# EAGLE schematic MOTOR_DRIVER_dupl_everything_mount_holes (EAGLE 8.0.1)

## Sheet 1 of 8: Motor Driver Schematic
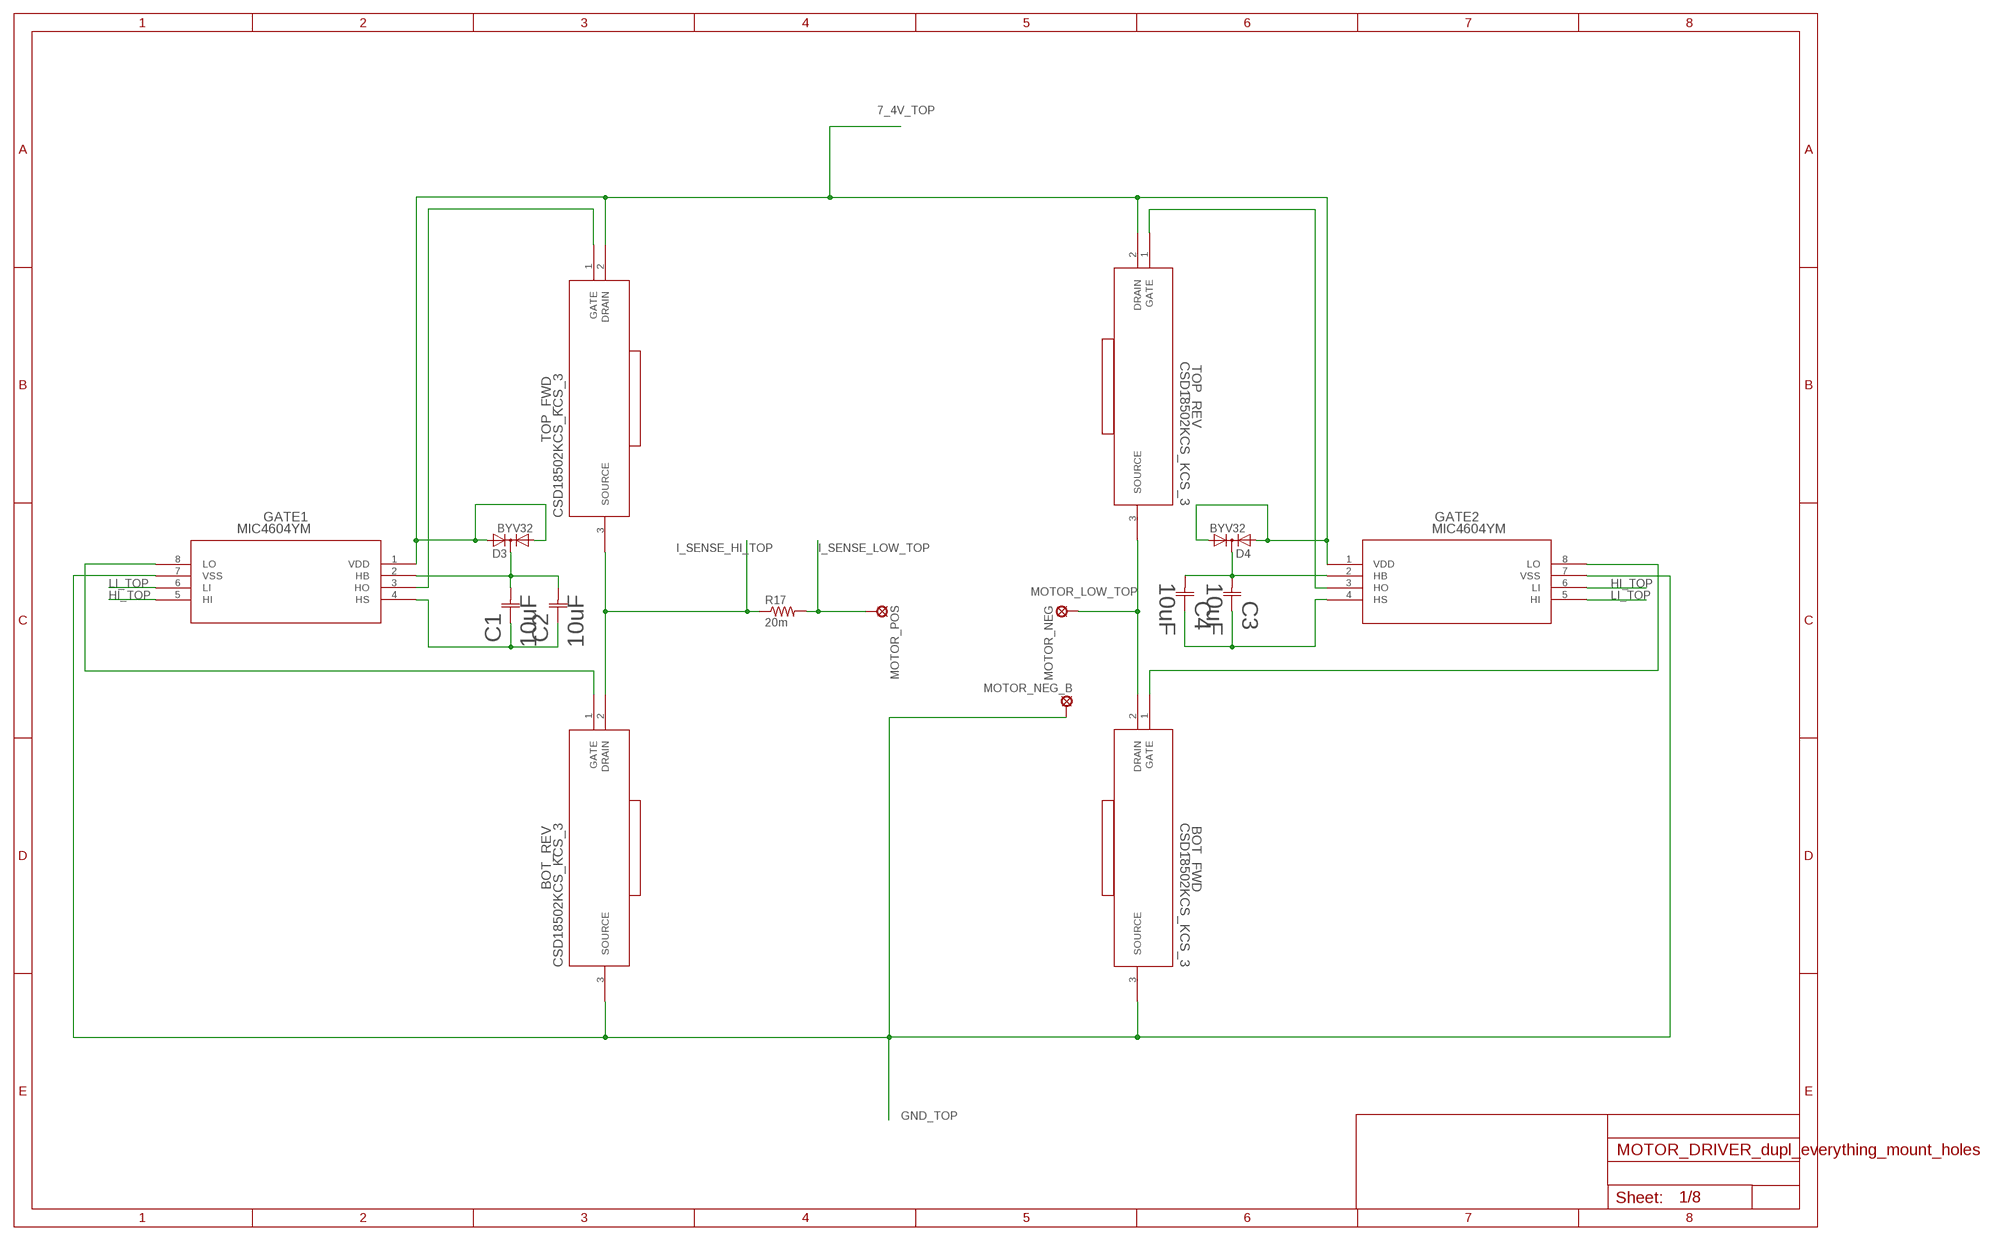
[diagram p0: schematic, sheet 1]

### Parts
BOT_FWD  CSD18502KCS_KCS_3  [KCS3]
BOT_REV  CSD18502KCS_KCS_3  [KCS3]
C1  10uF  EEE1VA100WR  [CAP_EEE_B]
C2  10uF  EEE1VA100WR  [CAP_EEE_B]
C3  10uF  EEE1VA100WR  [CAP_EEE_B]
C4  10uF  EEE1VA100WR  [CAP_EEE_B]
D3  BYV32  [TO220ABS]
D4  BYV32  [TO220ABS]
GATE1  MIC4604YM  [SOIC-8_M]
GATE2  MIC4604YM  [SOIC-8_M]
MOTOR_NEG  SE14  [SE14]
MOTOR_NEG_B  SE14  [SE14]
MOTOR_POS  SE14  [SE14]
R17  20m  R-US_R2512  [R2512]
TOP_FWD  CSD18502KCS_KCS_3  [KCS3]
TOP_REV  CSD18502KCS_KCS_3  [KCS3]
U$2  HEATSINK  [HEATSINK]
U$4  HEATSINK  [HEATSINK]
U$5  HEATSINK  [HEATSINK]
U$6  HEATSINK  [HEATSINK]

### Nets
7_4V_TOP: D3.A1 D3.A2 D4.A1 D4.A2 GATE1.1(VDD) GATE2.1(VDD) TOP_FWD.2(DRAIN) TOP_REV.2(DRAIN) ; also sheet 2,3,4
GND_TOP: BOT_FWD.3(SOURCE) BOT_REV.3(SOURCE) GATE1.7(VSS) GATE2.7(VSS) MOTOR_NEG_B.MP ; also sheet 2,3,4
HI_TOP: GATE1.5(HI) GATE2.6(LI) ; also sheet 3
I_SENSE_HI_TOP: BOT_REV.2(DRAIN) R17.1 TOP_FWD.3(SOURCE) ; also sheet 2
I_SENSE_LOW_TOP: MOTOR_POS.MP R17.2 ; also sheet 2,3
LI_TOP: GATE1.6(LI) GATE2.5(HI) ; also sheet 3
MOTOR_LOW_TOP: BOT_FWD.2(DRAIN) MOTOR_NEG.MP TOP_REV.3(SOURCE) ; also sheet 3
N$2: BOT_REV.1(GATE) GATE1.8(LO)
N$3: GATE1.3(HO) TOP_FWD.1(GATE)
N$4: C1.1 C2.1 GATE1.4(HS)
N$5: C1.2 C2.2 D3.C GATE1.2(HB)
N$9: BOT_FWD.1(GATE) GATE2.8(LO)
N$10: GATE2.3(HO) TOP_REV.1(GATE)
N$11: C3.1 C4.1 GATE2.4(HS)
N$12: C3.2 C4.2 D4.C GATE2.2(HB)

## Sheet 2 of 8: Microcontroller schematic
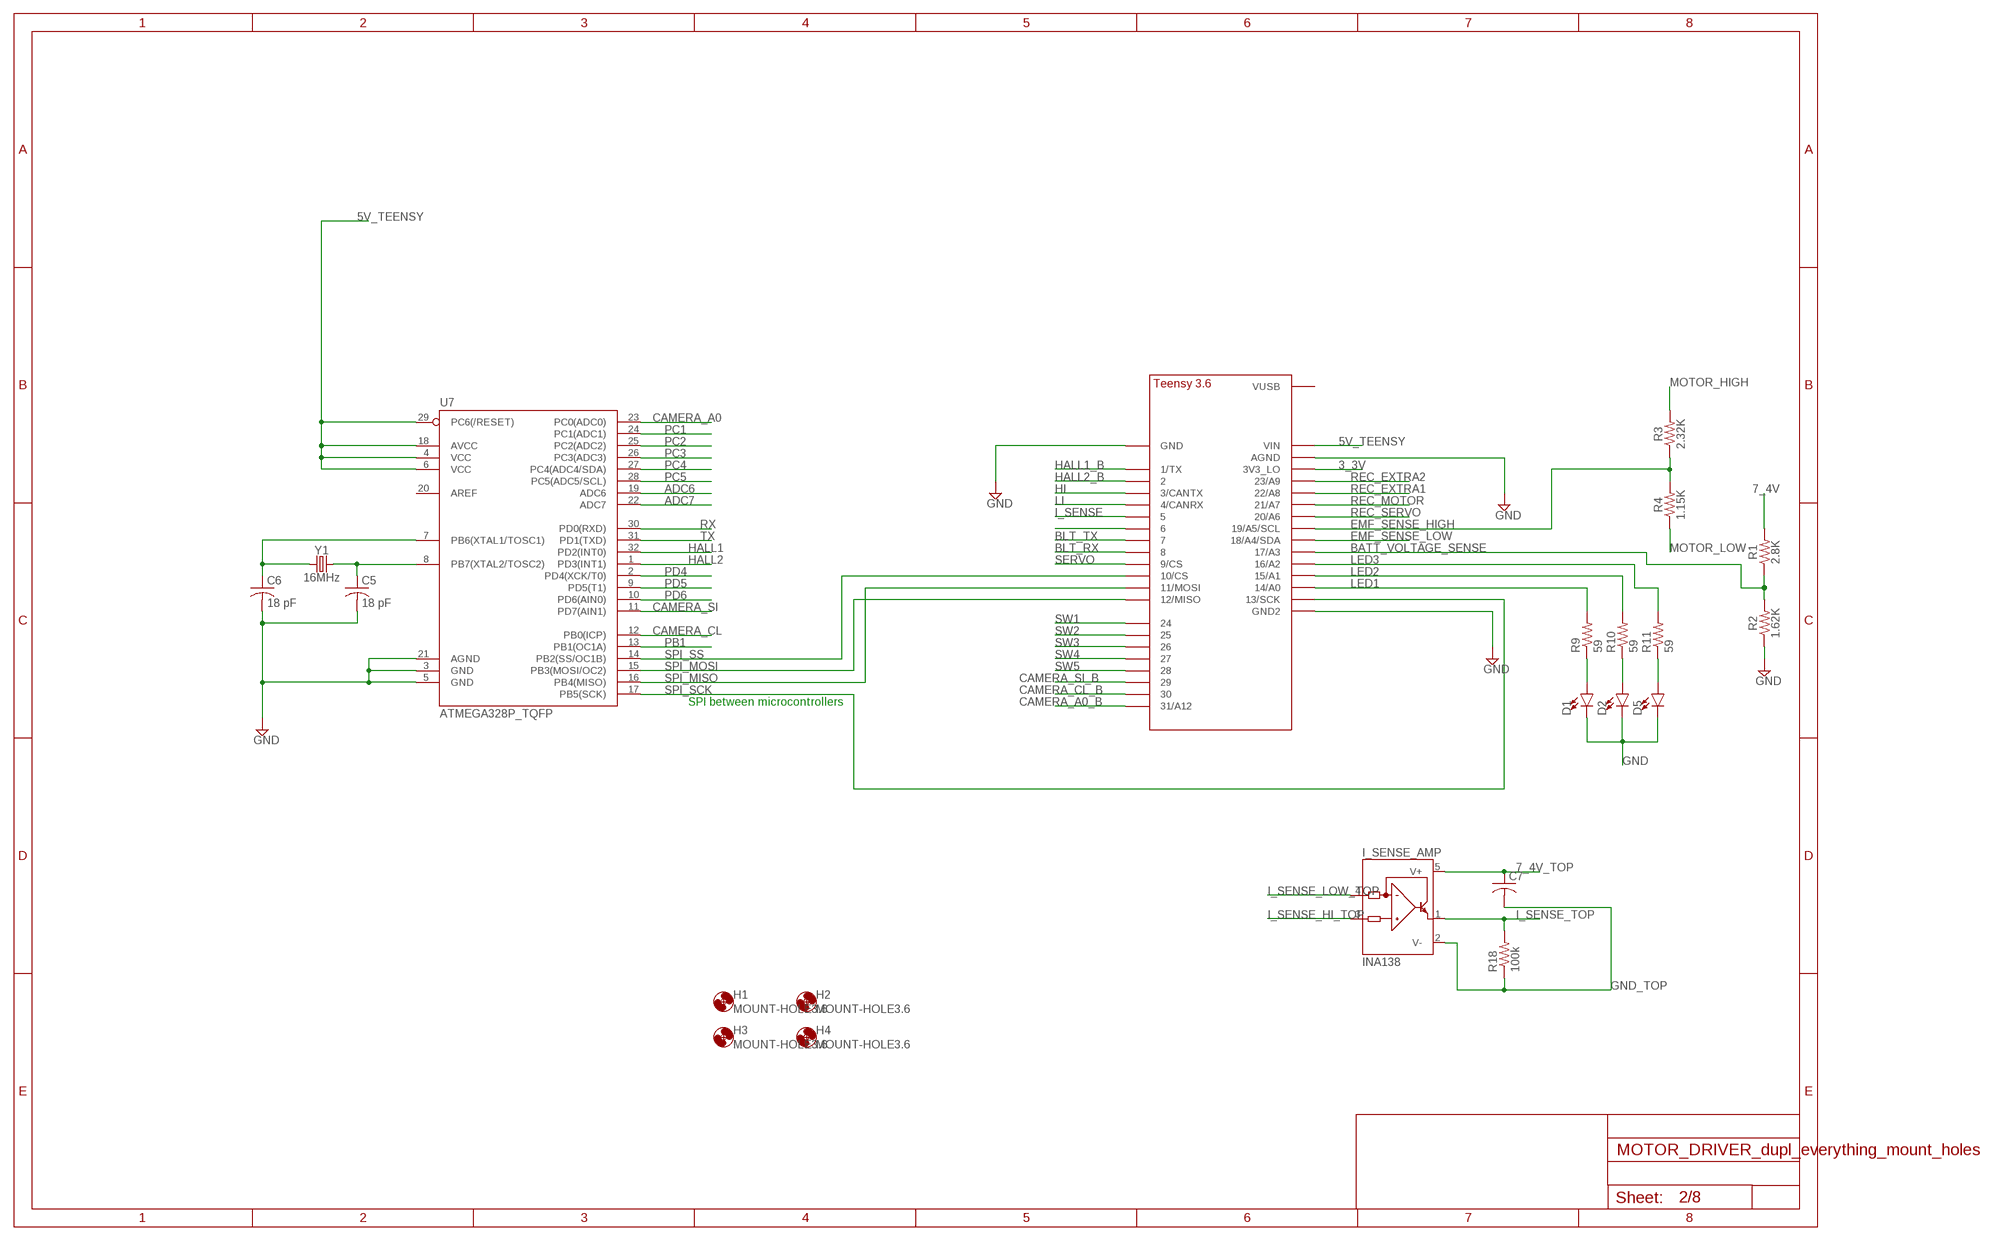
[diagram p1: schematic, sheet 2]

### Parts
C5  18 pF  C-USC0603  [C0603]
C6  18 pF  C-USC0603  [C0603]
C7  C-USC0603  [C0603]
D1  LED0603  [LED-0603]
D2  LED0603  [LED-0603]
D5  LED0603  [LED-0603]
H1  MOUNT-HOLE3.6  [3,6]
H2  MOUNT-HOLE3.6  [3,6]
H3  MOUNT-HOLE3.6  [3,6]
H4  MOUNT-HOLE3.6  [3,6]
I_SENSE_AMP  INA138  [SOT23-5]
R1  2.8K  0.3OHM-0805-1/8W-1%  [0805]
R2  1.62K  0.3OHM-0805-1/8W-1%  [0805]
R3  2.32K  0.3OHM-0805-1/8W-1%  [0805]
R4  1.15K  0.3OHM-0805-1/8W-1%  [0805]
R9  59  R-US_R0805  [R0805]
R10  59  R-US_R0805  [R0805]
R11  59  R-US_R0805  [R0805]
R18  100k  R-US_R0603  [R0603]
U7  ATMEGA328P_TQFP  [TQFP32-08]
U$1  TEENSY_3.5/3.6_FEWER  [TEENSY_3.5/3.6_BASIC_FEWER_PIN]
Y1  16MHz  CRYSTAL-16MHZPTH-HC49US  [HC49US]

### Nets
3_3V: U$1.3V3_LO ; also sheet 3
5V_TEENSY: U7.4(VCC) U7.6(VCC) U7.18(AVCC) U7.29(PC6(/RESET)) U$1.VIN ; also sheet 3
7_4V: R1.2 ; also sheet 3,4
7_4V_TOP: C7.1 I_SENSE_AMP.5(V+) ; also sheet 1,3,4
ADC6: U7.19(ADC6) ; also sheet 3
ADC7: U7.22(ADC7) ; also sheet 3
BATT_VOLTAGE_SENSE: R1.1 R2.2 U$1.17/A3
BLT_RX: U$1.8 ; also sheet 3
BLT_TX: U$1.7 ; also sheet 3
CAMERA_A0: U7.23(PC0(ADC0)) ; also sheet 3
CAMERA_A0_B: U$1.31/A12 ; also sheet 3
CAMERA_CL: U7.12(PB0(ICP)) ; also sheet 3
CAMERA_CL_B: U$1.30 ; also sheet 3
CAMERA_SI: U7.11(PD7(AIN1)) ; also sheet 3
CAMERA_SI_B: U$1.29 ; also sheet 3
EMF_SENSE_HIGH: R3.1 R4.2 U$1.19/A5/SCL
EMF_SENSE_LOW: U$1.18/A4/SDA ; also sheet 3
GND: C5.2 C6.2 D1.C D2.C D5.C R2.1 U7.3(GND) U7.5(GND) U7.21(AGND) U$1.AGND U$1.GND U$1.GND2 ; also sheet 3,4
GND_TOP: C7.2 I_SENSE_AMP.2(V-) R18.1 ; also sheet 1,3,4
HALL1: U7.32(PD2(INT0)) ; also sheet 3
HALL1_B: U$1.1/TX ; also sheet 3
HALL2: U7.1(PD3(INT1)) ; also sheet 3
HALL2_B: U$1.2 ; also sheet 3
HI: U$1.3/CANTX ; also sheet 3
I_SENSE: U$1.5 ; also sheet 3
I_SENSE_HI_TOP: I_SENSE_AMP.3(IN+) ; also sheet 1
I_SENSE_LOW_TOP: I_SENSE_AMP.4(IN-) ; also sheet 1,3
I_SENSE_TOP: I_SENSE_AMP.1(OUT) R18.2 ; also sheet 3
LED1: R9.2 U$1.14/A0
LED2: R10.2 U$1.15/A1
LED3: R11.2 U$1.16/A2
LI: U$1.4/CANRX ; also sheet 3
LI2: U$1.6
MOTOR_HIGH: R3.2 ; also sheet 3
MOTOR_LOW: R4.1 ; also sheet 3
N$6: C6.1 U7.7(PB6(XTAL1/TOSC1)) Y1.1
N$7: C5.1 U7.8(PB7(XTAL2/TOSC2)) Y1.2
N$22: D1.A R9.1
N$23: D2.A R10.1
N$24: D5.A R11.1
PB1: U7.13(PB1(OC1A)) ; also sheet 3
PC1: U7.24(PC1(ADC1)) ; also sheet 3
PC2: U7.25(PC2(ADC2)) ; also sheet 3
PC3: U7.26(PC3(ADC3)) ; also sheet 3
PC4: U7.27(PC4(ADC4/SDA)) ; also sheet 3
PC5: U7.28(PC5(ADC5/SCL)) ; also sheet 3
PD4: U7.2(PD4(XCK/T0)) ; also sheet 3
PD5: U7.9(PD5(T1)) ; also sheet 3
PD6: U7.10(PD6(AIN0))
REC_EXTRA1: U$1.22/A8 ; also sheet 3
REC_EXTRA2: U$1.23/A9 ; also sheet 3
REC_MOTOR: U$1.21/A7 ; also sheet 3
REC_SERVO: U$1.20/A6 ; also sheet 3
RX: U7.30(PD0(RXD)) ; also sheet 3
SERVO: U$1.9/CS ; also sheet 3
SPI_MISO: U7.16(PB4(MISO)) U$1.11/MOSI
SPI_MOSI: U7.15(PB3(MOSI/OC2)) U$1.12/MISO
SPI_SCK: U7.17(PB5(SCK)) U$1.13/SCK
SPI_SS: U7.14(PB2(SS/OC1B)) U$1.10/CS
SW1: U$1.24 ; also sheet 3
SW2: U$1.25 ; also sheet 3
SW3: U$1.26 ; also sheet 3
SW4: U$1.27 ; also sheet 3
SW5: U$1.28
TX: U7.31(PD1(TXD)) ; also sheet 3
Unconnected: U7.20(AREF) U$1.VUSB

### Notes on the sheet
- SPI between microcontrollers

## Sheet 3 of 8: Header schematic
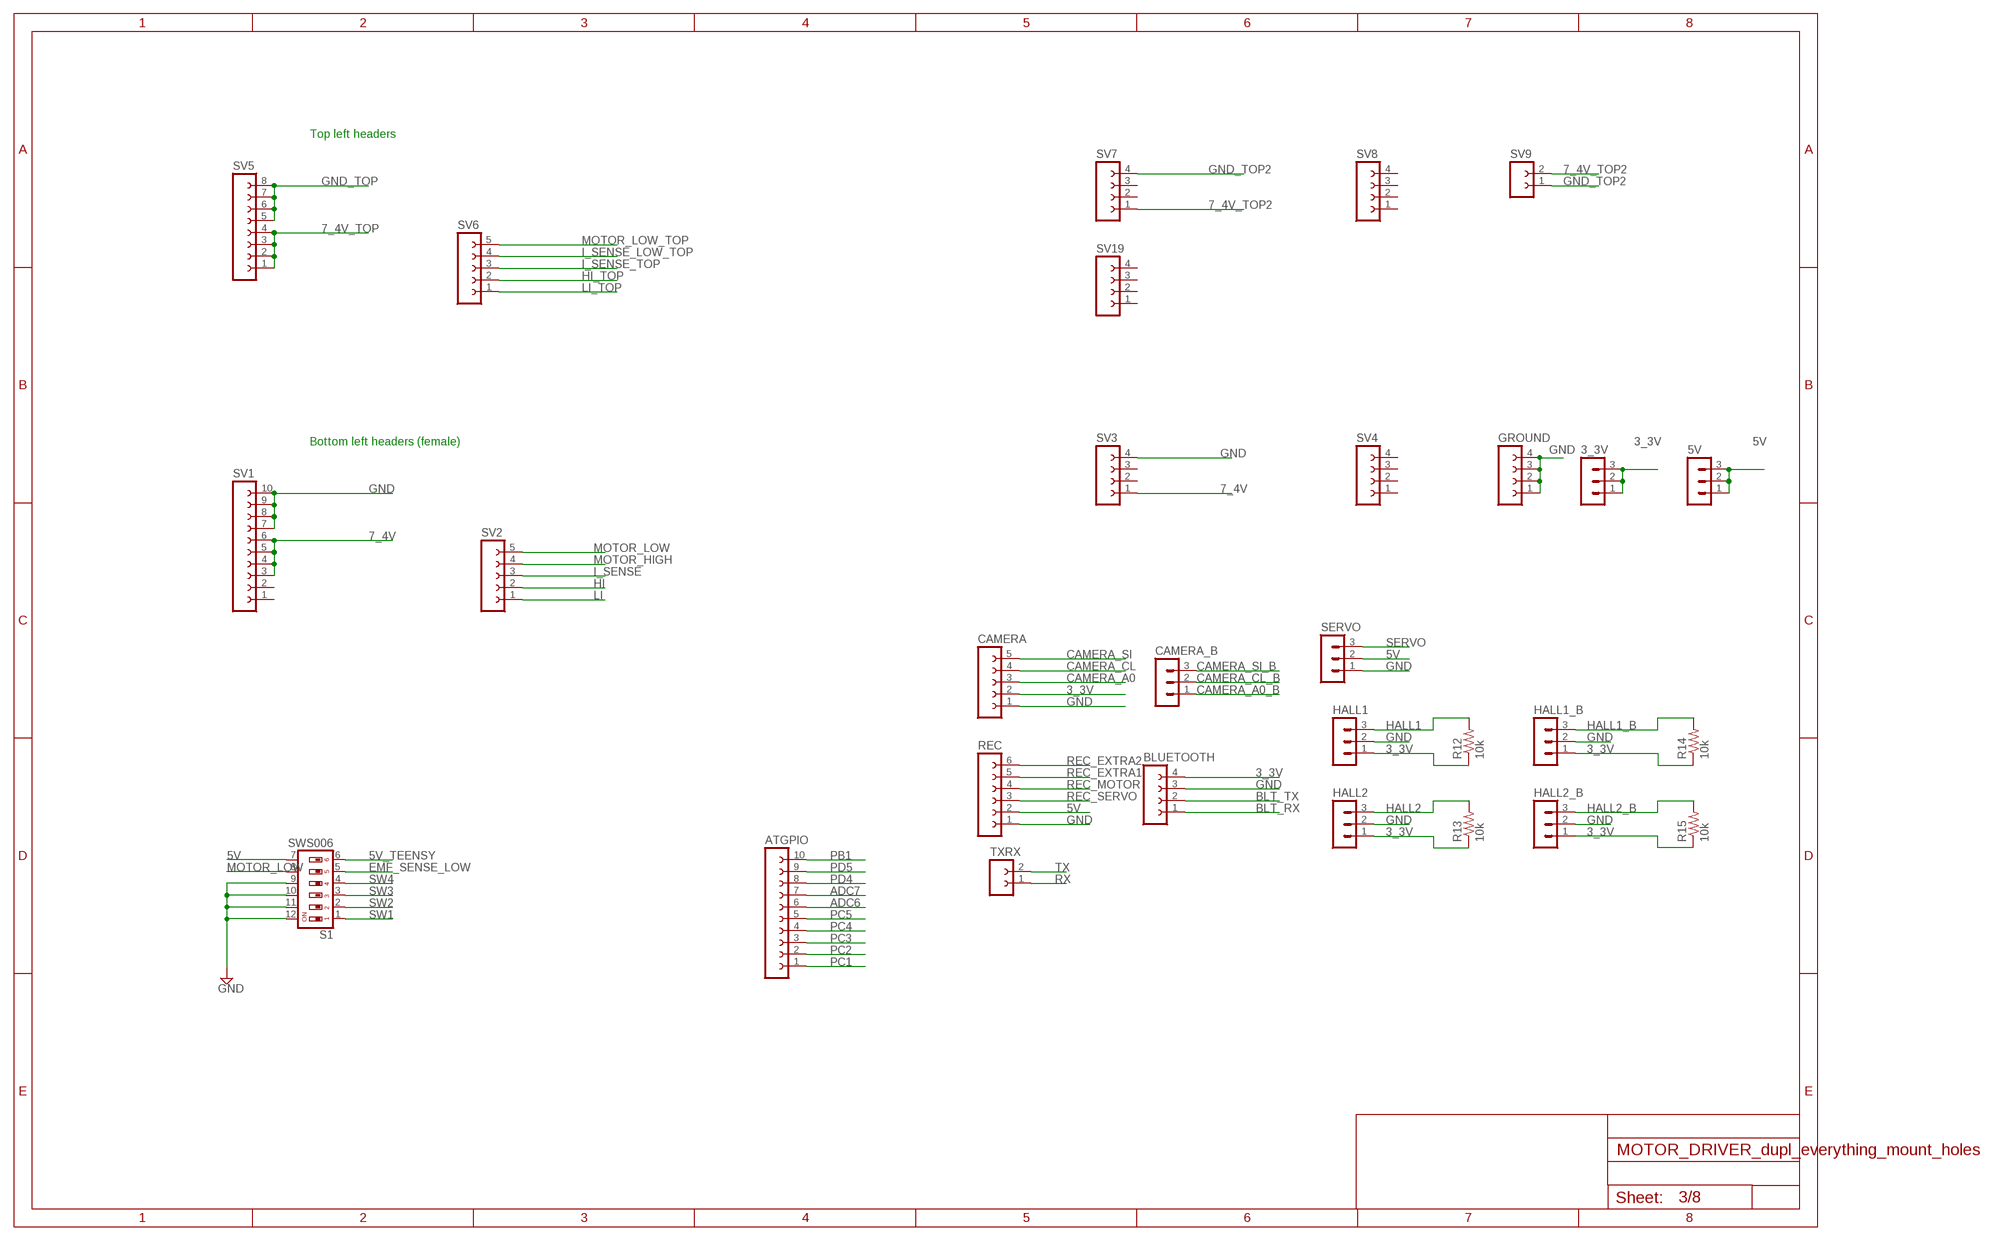
[diagram p2: schematic, sheet 3]

### Parts
3_3V  MA03-1  [MA03-1]
5V  MA03-1  [MA03-1]
ATGPIO  FE10-1  [FE10]
BLUETOOTH  FE04-1  [FE04-1]
CAMERA  FE05-1  [FE05-1]
CAMERA_B  MA03-1  [MA03-1]
GROUND  FE04-1  [FE04-1]
HALL1  MA03-1  [MA03-1]
HALL1_B  MA03-1  [MA03-1]
HALL2  MA03-1  [MA03-1]
HALL2_B  MA03-1  [MA03-1]
R12  10k  R-US_R0603  [R0603]
R13  10k  R-US_R0603  [R0603]
R14  10k  R-US_R0603  [R0603]
R15  10k  R-US_R0603  [R0603]
REC  FE06-1  [FE06]
S1  SWS006  [SMS-006]
SERVO  MA03-1  [MA03-1]
SV1  FE10-1  [FE10]
SV2  FE05-1  [FE05-1]
SV3  FE04-1  [FE04-1]
SV4  FE04-1  [FE04-1]
SV5  FE08-1  [FE08]
SV6  FE05-1  [FE05-1]
SV7  FE04-1  [FE04-1]
SV8  FE04-1  [FE04-1]
SV9  FE02-1  [FE02-1]
SV19  FE04-1  [FE04-1]
TXRX  FE02-1  [FE02-1]

### Nets
3_3V: 3_3V.1 3_3V.2 3_3V.3 BLUETOOTH.4 CAMERA.2 HALL1.1 HALL1_B.1 HALL2.1 HALL2_B.1 R12.1 R13.1 R14.1 R15.1 ; also sheet 2
5V: 5V.1 5V.2 5V.3 REC.2 S1.7 SERVO.2 ; also sheet 4
5V_TEENSY: S1.6 ; also sheet 2
7_4V: SV1.3 SV1.4 SV1.5 SV1.6 SV3.1 ; also sheet 2,4
7_4V_TOP: SV5.1 SV5.2 SV5.3 SV5.4 ; also sheet 1,2,4
7_4V_TOP2: SV7.1 SV9.2 ; also sheet 4
ADC6: ATGPIO.6 ; also sheet 2
ADC7: ATGPIO.7 ; also sheet 2
BLT_RX: BLUETOOTH.1 ; also sheet 2
BLT_TX: BLUETOOTH.2 ; also sheet 2
CAMERA_A0: CAMERA.3 ; also sheet 2
CAMERA_A0_B: CAMERA_B.1 ; also sheet 2
CAMERA_CL: CAMERA.4 ; also sheet 2
CAMERA_CL_B: CAMERA_B.2 ; also sheet 2
CAMERA_SI: CAMERA.5 ; also sheet 2
CAMERA_SI_B: CAMERA_B.3 ; also sheet 2
EMF_SENSE_LOW: S1.5 ; also sheet 2
GND: BLUETOOTH.3 CAMERA.1 GROUND.1 GROUND.2 GROUND.3 GROUND.4 HALL1.2 HALL1_B.2 HALL2.2 HALL2_B.2 REC.1 S1.9 S1.10 S1.11 S1.12 SERVO.1 SV1.7 SV1.8 SV1.9 SV1.10 SV3.4 ; also sheet 2,4
GND_TOP: SV5.5 SV5.6 SV5.7 SV5.8 ; also sheet 1,2,4
GND_TOP2: SV7.4 SV9.1 ; also sheet 4
HALL1: HALL1.3 R12.2 ; also sheet 2
HALL1_B: HALL1_B.3 R14.2 ; also sheet 2
HALL2: HALL2.3 R13.2 ; also sheet 2
HALL2_B: HALL2_B.3 R15.2 ; also sheet 2
HI: SV2.2 ; also sheet 2
HI_TOP: SV6.2 ; also sheet 1
I_SENSE: SV2.3 ; also sheet 2
I_SENSE_LOW_TOP: SV6.4 ; also sheet 1,2
I_SENSE_TOP: SV6.3 ; also sheet 2
LI: SV2.1 ; also sheet 2
LI_TOP: SV6.1 ; also sheet 1
MOTOR_HIGH: SV2.4 ; also sheet 2
MOTOR_LOW: S1.8 SV2.5 ; also sheet 2
MOTOR_LOW_TOP: SV6.5 ; also sheet 1
PB1: ATGPIO.10 ; also sheet 2
PC1: ATGPIO.1 ; also sheet 2
PC2: ATGPIO.2 ; also sheet 2
PC3: ATGPIO.3 ; also sheet 2
PC4: ATGPIO.4 ; also sheet 2
PC5: ATGPIO.5 ; also sheet 2
PD4: ATGPIO.8 ; also sheet 2
PD5: ATGPIO.9 ; also sheet 2
REC_EXTRA1: REC.5 ; also sheet 2
REC_EXTRA2: REC.6 ; also sheet 2
REC_MOTOR: REC.4 ; also sheet 2
REC_SERVO: REC.3 ; also sheet 2
RX: TXRX.1 ; also sheet 2
SERVO: SERVO.3 ; also sheet 2
SW1: S1.1 ; also sheet 2
SW2: S1.2 ; also sheet 2
SW3: S1.3 ; also sheet 2
SW4: S1.4 ; also sheet 2
TX: TXRX.2 ; also sheet 2
Unconnected: SV1.1 SV1.2 SV3.2 SV3.3 SV4.1 SV4.2 SV4.3 SV4.4 SV7.2 SV7.3 SV8.1 SV8.2 SV8.3 SV8.4 SV19.1 SV19.2 SV19.3 SV19.4

### Notes on the sheet
- Top left headers
- Bottom left headers (female)

## Sheet 4 of 8: Power Schematic
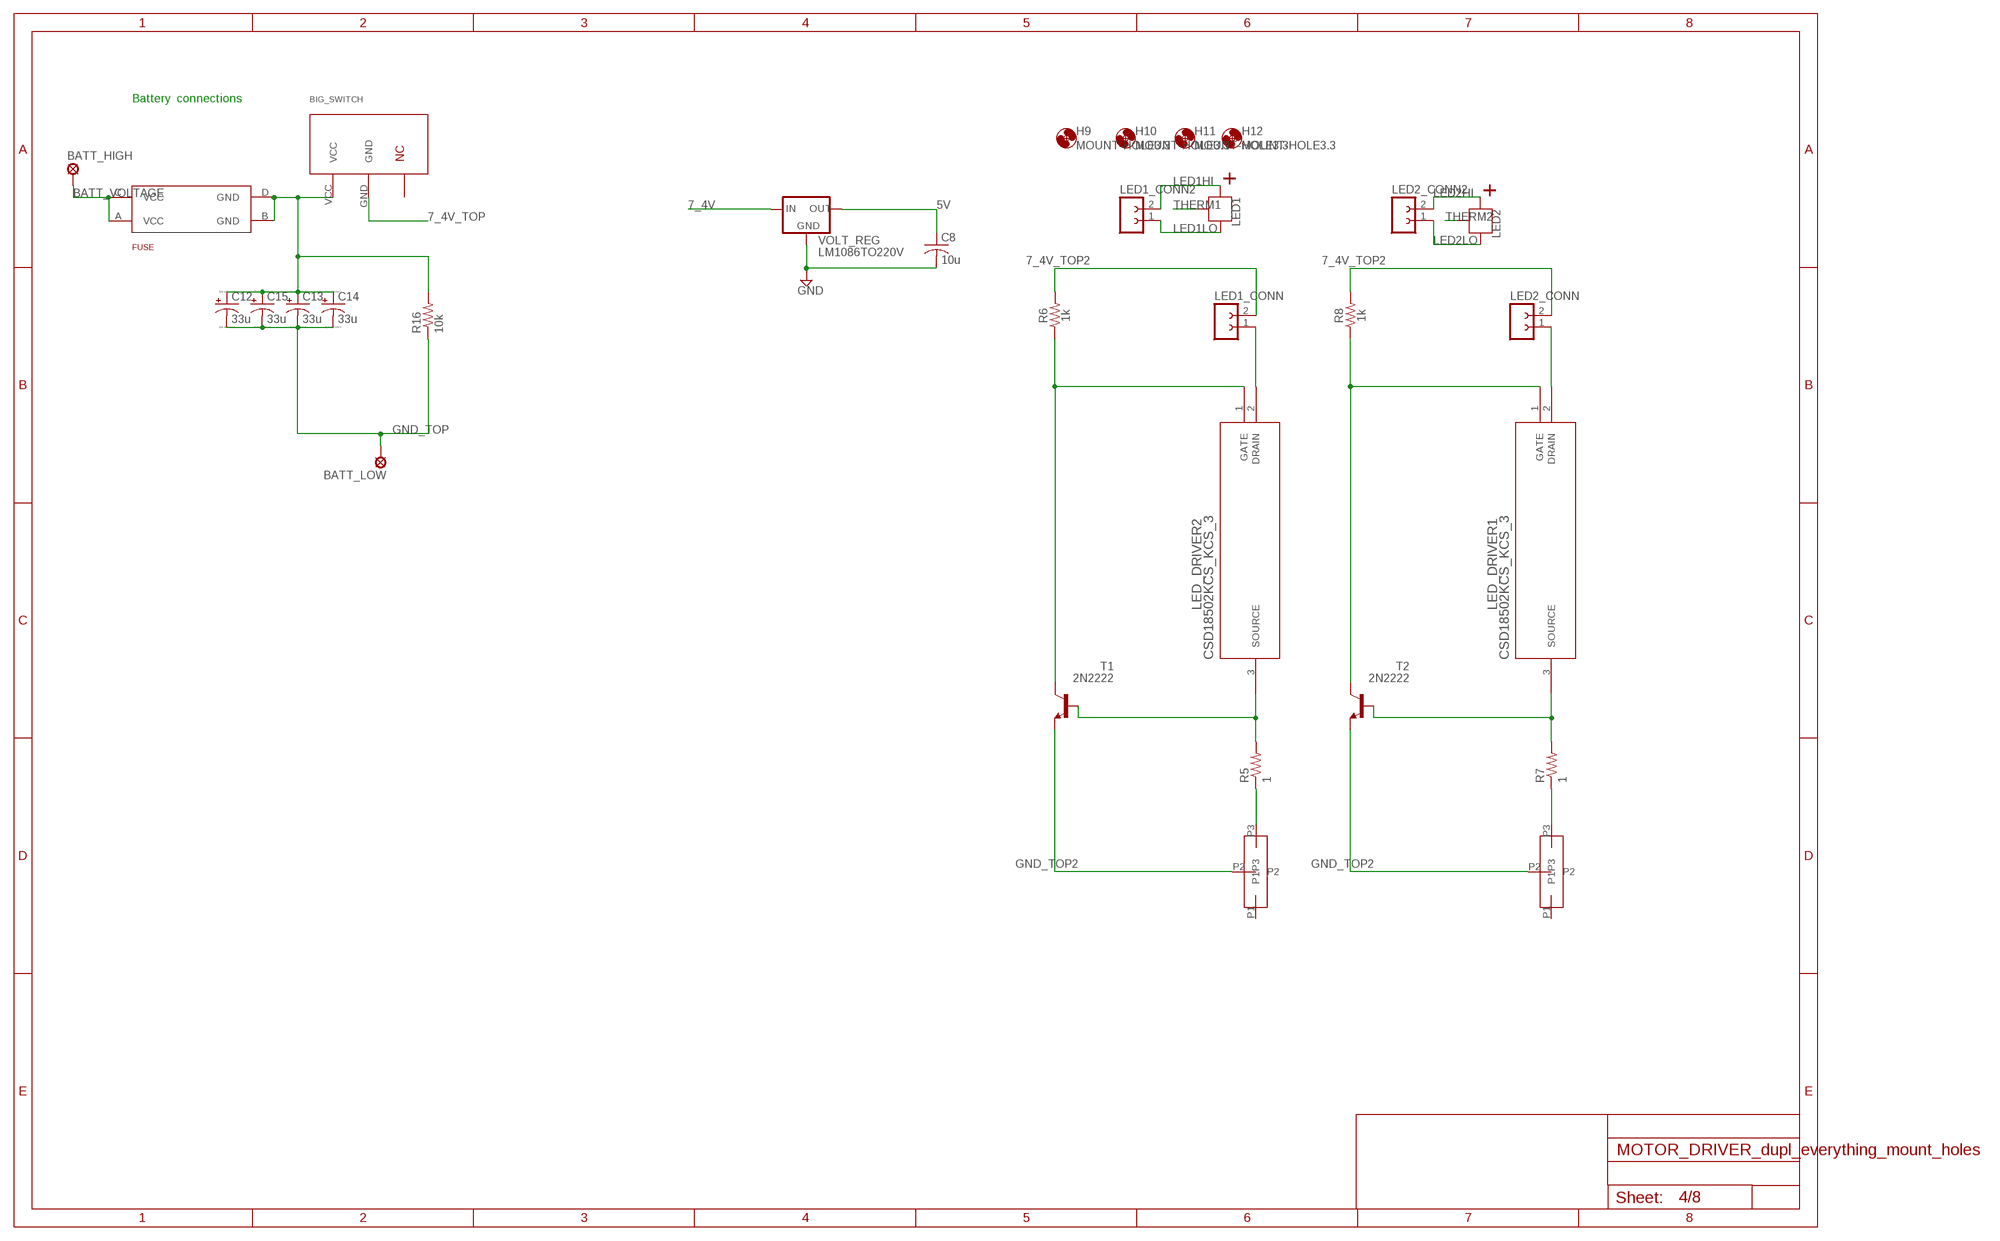
[diagram p3: schematic, sheet 4]

### Parts
BATT_HIGH  SE14  [SE14]
BATT_LOW  SE14  [SE14]
BIG_SWITCH  BIGSWITCH  [BIGSWITCH]
C8  10u  C-USC0805  [C0805]
C12  33u  CPOL-US153CLV-1010  [153CLV-1010]
C13  33u  CPOL-US153CLV-1010  [153CLV-1010]
C14  33u  CPOL-US153CLV-1010  [153CLV-1010]
C15  33u  CPOL-US153CLV-1010  [153CLV-1010]
FUSE  FUSEHOLDER3588  [FUSEHOLDER3588]
H9  MOUNT-HOLE3.3  [3,3]
H10  MOUNT-HOLE3.3  [3,3]
H11  MOUNT-HOLE3.3  [3,3]
H12  MOUNT-HOLE3.3  [3,3]
LED1  CREE_XP  [XP]
LED1_CONN  FE02-1  [FE02-1]
LED1_CONN2  FE02-1  [FE02-1]
LED2  CREE_XP  [XP]
LED2_CONN  FE02-1  [FE02-1]
LED2_CONN2  FE02-1  [FE02-1]
LED_DRIVER1  CSD18502KCS_KCS_3  [KCS3]
LED_DRIVER2  CSD18502KCS_KCS_3  [KCS3]
R5  1  R-US_R2512  [R2512]
R6  1k  1KOHM-HORIZ-1/4W-1%  [AXIAL-0.3]
R7  1  R-US_R2512  [R2512]
R8  1k  1KOHM-HORIZ-1/4W-1%  [AXIAL-0.3]
R16  10k  R-US_R0603  [R0603]
T1  2N2222  [TO18]
T2  2N2222  [TO18]
U$3  POT  [POT]
U$7  POT  [POT]
VOLT_REG  LM1086TO220V  [TO220S]

### Nets
5V: C8.1 VOLT_REG.2(OUT) ; also sheet 3
7_4V: VOLT_REG.3(IN) ; also sheet 2,3
7_4V_TOP: BIG_SWITCH.GND ; also sheet 1,2,3
7_4V_TOP2: LED1_CONN.2 LED2_CONN.2 R6.P$2 R8.P$2 ; also sheet 3
BATT_VOLTAGE: BATT_HIGH.MP FUSE.A(VCC) FUSE.C(VCC)
GND: C8.2 VOLT_REG.1(GND) ; also sheet 2,3
GND_TOP: BATT_LOW.MP C12.- C13.- C14.- C15.- R16.1 ; also sheet 1,2,3
GND_TOP2: T1.1(E) T2.1(E) U$3.P2 U$7.P2 ; also sheet 3
LED1HI: LED1.POSITIVE LED1.POSITIVE1(POSITIVE) LED1_CONN2.2
LED1LO: LED1.NEGATIVE LED1.NEGATIVE1(NEGATIVE) LED1_CONN2.1
LED2HI: LED2.POSITIVE LED2.POSITIVE1(POSITIVE) LED2_CONN2.2
LED2LO: LED2.NEGATIVE LED2.NEGATIVE1(NEGATIVE) LED2_CONN2.1
N$1: R5.1 U$7.P3
N$8: LED_DRIVER2.3(SOURCE) R5.2 T1.2(B)
N$13: R7.1 U$3.P3
N$16: LED_DRIVER2.1(GATE) R6.P$1 T1.3(C)
N$17: LED1_CONN.1 LED_DRIVER2.2(DRAIN)
N$18: LED_DRIVER1.3(SOURCE) R7.2 T2.2(B)
N$19: LED_DRIVER1.1(GATE) R8.P$1 T2.3(C)
N$20: LED2_CONN.1 LED_DRIVER1.2(DRAIN)
N$21: BIG_SWITCH.VCC C12.+ C13.+ C14.+ C15.+ FUSE.B(GND) FUSE.D(GND) R16.2
THERM1: LED1.THERMAL
THERM2: LED2.THERMAL
Unconnected: U$3.P1 U$7.P1

### Notes on the sheet
- Battery  connections

## Sheet 5 of 8: Motor Driver Schematic
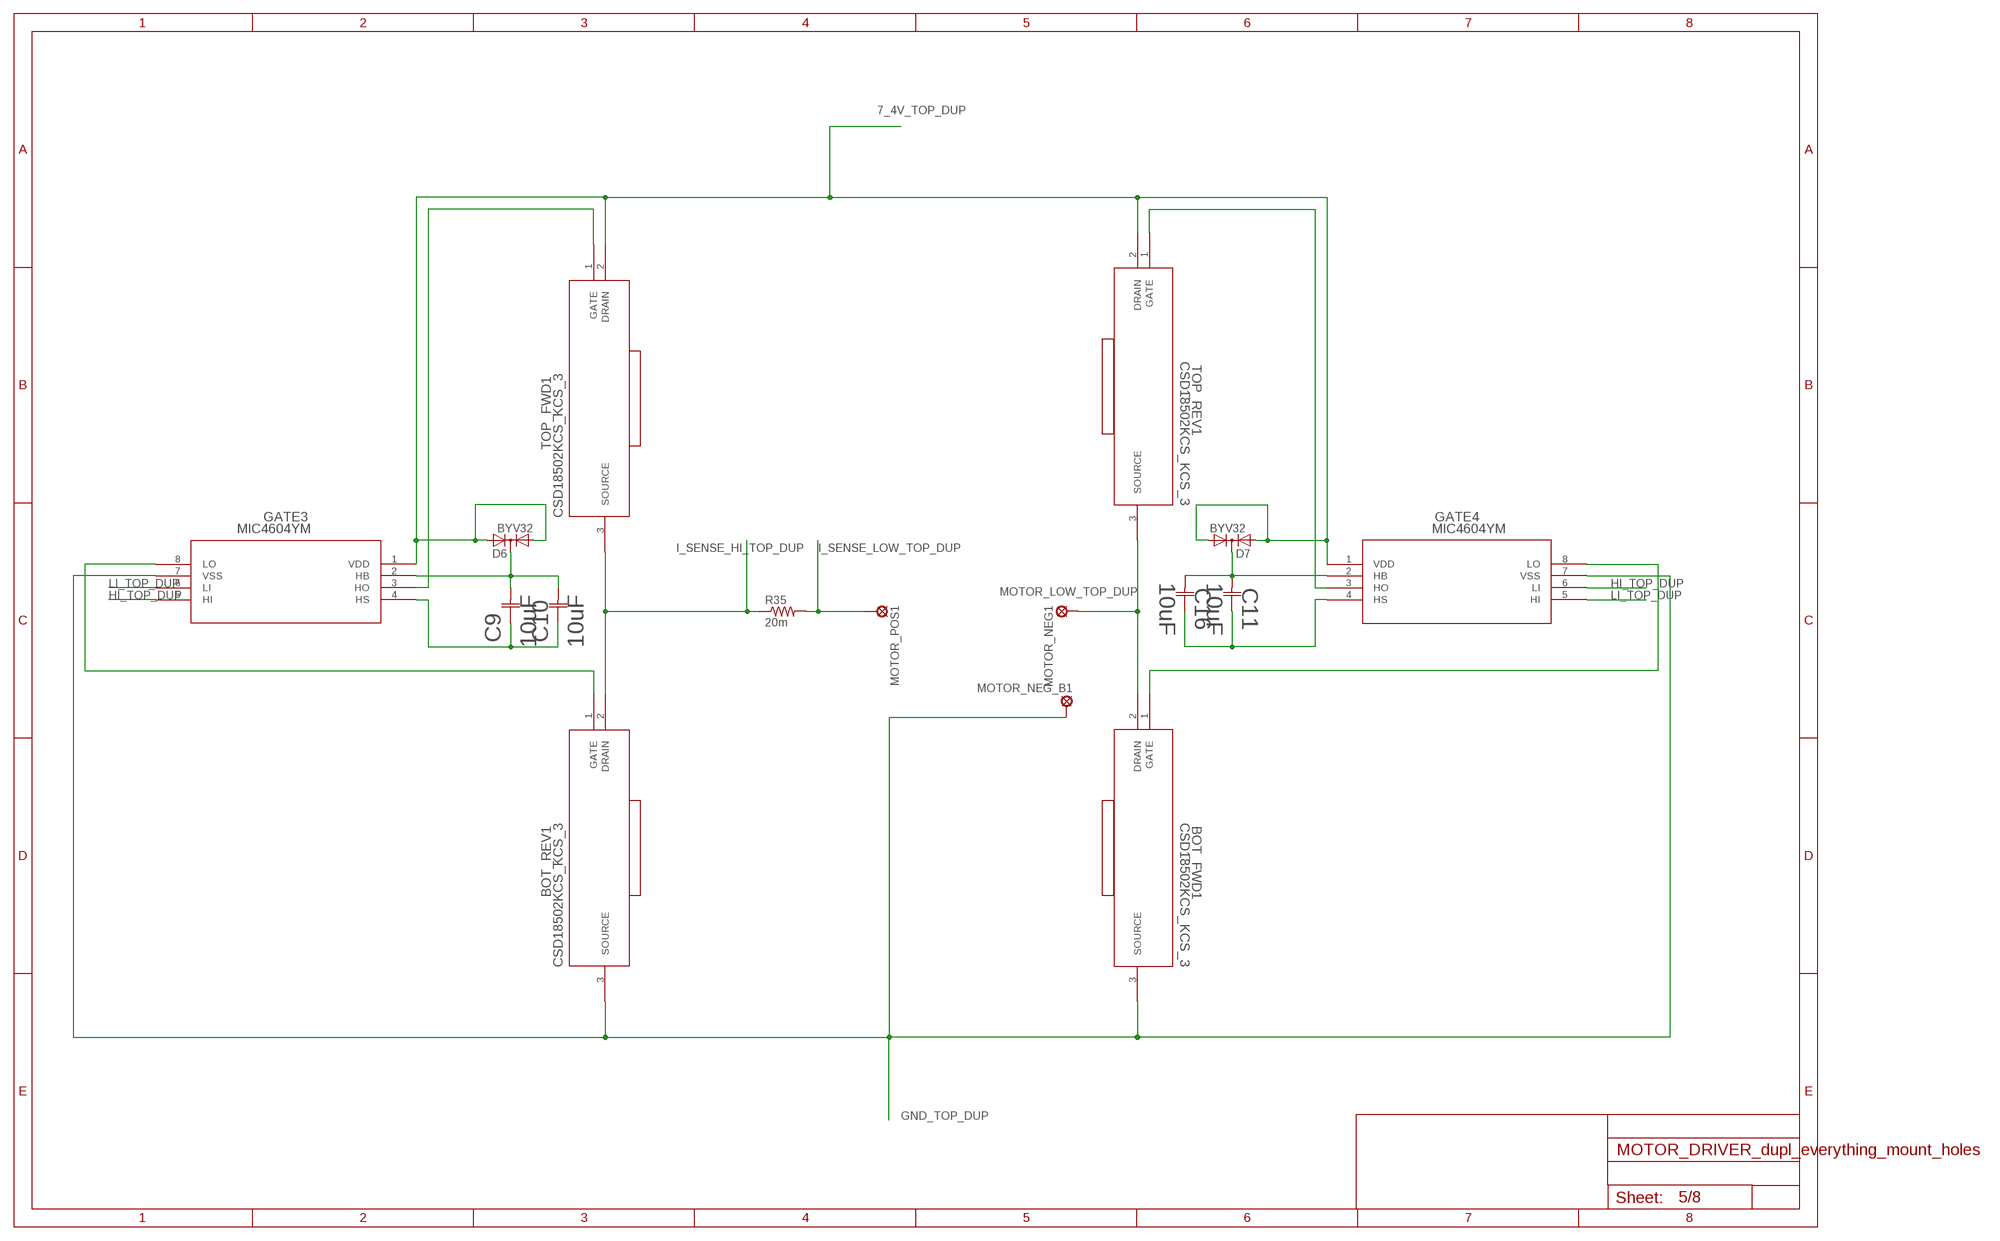
[diagram p4: schematic, sheet 5]

### Parts
BOT_FWD1  CSD18502KCS_KCS_3  [KCS3]
BOT_REV1  CSD18502KCS_KCS_3  [KCS3]
C9  10uF  EEE1VA100WR  [CAP_EEE_B]
C10  10uF  EEE1VA100WR  [CAP_EEE_B]
C11  10uF  EEE1VA100WR  [CAP_EEE_B]
C16  10uF  EEE1VA100WR  [CAP_EEE_B]
D6  BYV32  [TO220ABS]
D7  BYV32  [TO220ABS]
GATE3  MIC4604YM  [SOIC-8_M]
GATE4  MIC4604YM  [SOIC-8_M]
MOTOR_NEG1  SE14  [SE14]
MOTOR_NEG_B1  SE14  [SE14]
MOTOR_POS1  SE14  [SE14]
R35  20m  R-US_R2512  [R2512]
TOP_FWD1  CSD18502KCS_KCS_3  [KCS3]
TOP_REV1  CSD18502KCS_KCS_3  [KCS3]
U$10  HEATSINK  [HEATSINK]
U$11  HEATSINK  [HEATSINK]
U$12  HEATSINK  [HEATSINK]
U$13  HEATSINK  [HEATSINK]

### Nets
7_4V_TOP_DUP: D6.A1 D6.A2 D7.A1 D7.A2 GATE3.1(VDD) GATE4.1(VDD) TOP_FWD1.2(DRAIN) TOP_REV1.2(DRAIN) ; also sheet 6,7,8
GND_TOP_DUP: BOT_FWD1.3(SOURCE) BOT_REV1.3(SOURCE) GATE3.7(VSS) GATE4.7(VSS) MOTOR_NEG_B1.MP ; also sheet 6,7,8
HI_TOP_DUP: GATE3.5(HI) GATE4.6(LI) ; also sheet 7
I_SENSE_HI_TOP_DUP: BOT_REV1.2(DRAIN) R35.1 TOP_FWD1.3(SOURCE) ; also sheet 6
I_SENSE_LOW_TOP_DUP: MOTOR_POS1.MP R35.2 ; also sheet 6,7
LI_TOP_DUP: GATE3.6(LI) GATE4.5(HI) ; also sheet 7
MOTOR_LOW_TOP_DUP: BOT_FWD1.2(DRAIN) MOTOR_NEG1.MP TOP_REV1.3(SOURCE) ; also sheet 7
N$25: BOT_REV1.1(GATE) GATE3.8(LO)
N$26: GATE3.3(HO) TOP_FWD1.1(GATE)
N$27: C9.1 C10.1 GATE3.4(HS)
N$28: C9.2 C10.2 D6.C GATE3.2(HB)
N$29: BOT_FWD1.1(GATE) GATE4.8(LO)
N$30: GATE4.3(HO) TOP_REV1.1(GATE)
N$31: C11.1 C16.1 GATE4.4(HS)
N$32: C11.2 C16.2 D7.C GATE4.2(HB)

## Sheet 6 of 8: Microcontroller schematic
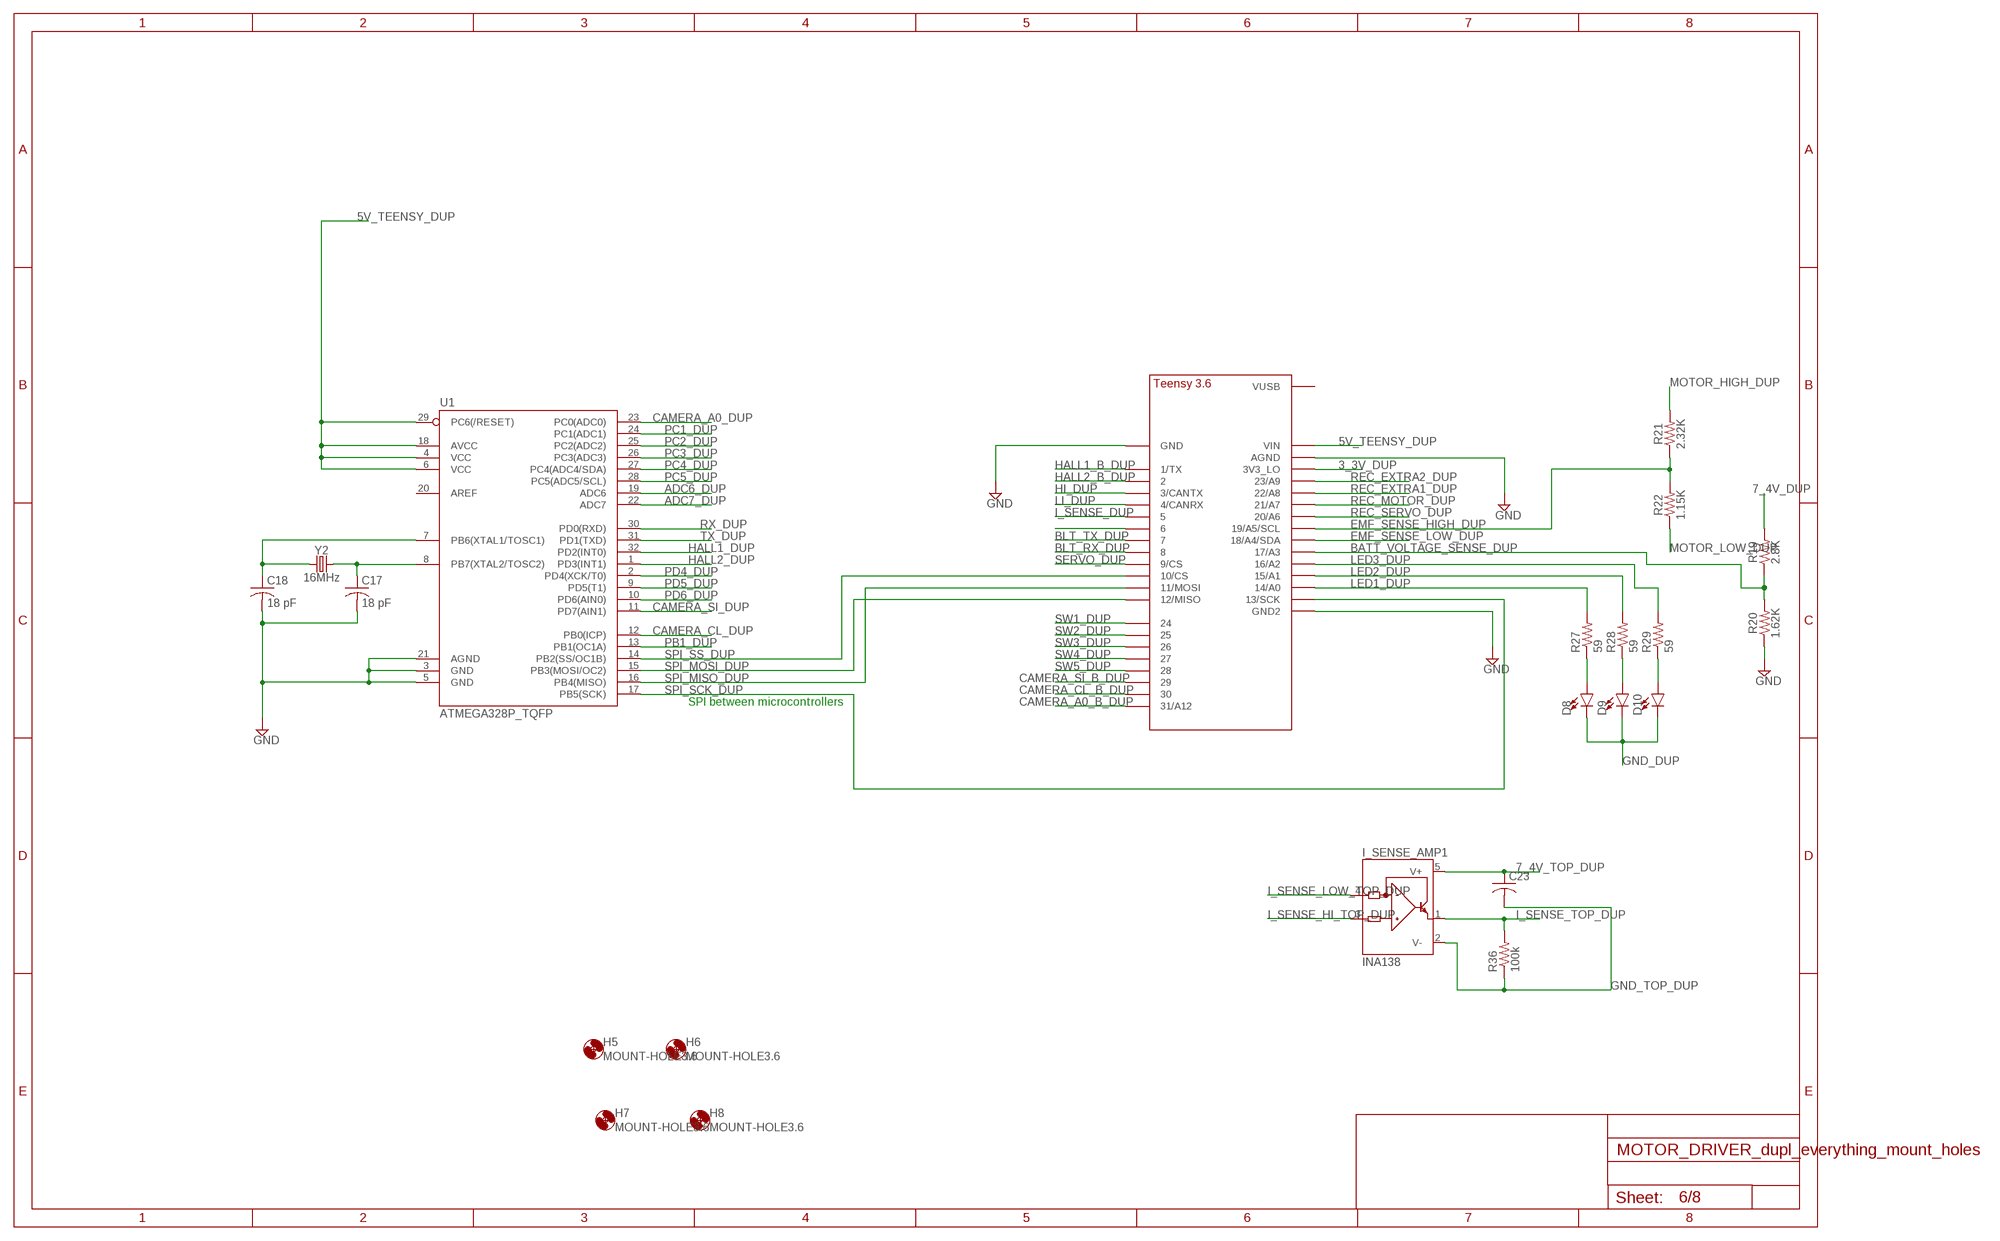
[diagram p5: schematic, sheet 6]

### Parts
C17  18 pF  C-USC0603  [C0603]
C18  18 pF  C-USC0603  [C0603]
C23  C-USC0603  [C0603]
D8  LED0603  [LED-0603]
D9  LED0603  [LED-0603]
D10  LED0603  [LED-0603]
H5  MOUNT-HOLE3.6  [3,6]
H6  MOUNT-HOLE3.6  [3,6]
H7  MOUNT-HOLE3.6  [3,6]
H8  MOUNT-HOLE3.6  [3,6]
I_SENSE_AMP1  INA138  [SOT23-5]
R19  2.8K  0.3OHM-0805-1/8W-1%  [0805]
R20  1.62K  0.3OHM-0805-1/8W-1%  [0805]
R21  2.32K  0.3OHM-0805-1/8W-1%  [0805]
R22  1.15K  0.3OHM-0805-1/8W-1%  [0805]
R27  59  R-US_R0805  [R0805]
R28  59  R-US_R0805  [R0805]
R29  59  R-US_R0805  [R0805]
R36  100k  R-US_R0603  [R0603]
U1  ATMEGA328P_TQFP  [TQFP32-08]
U$9  TEENSY_3.5/3.6_FEWER  [TEENSY_3.5/3.6_BASIC_FEWER_PIN]
Y2  16MHz  CRYSTAL-16MHZPTH-HC49US  [HC49US]

### Nets
3_3V_DUP: U$9.3V3_LO ; also sheet 7
5V_TEENSY_DUP: U1.4(VCC) U1.6(VCC) U1.18(AVCC) U1.29(PC6(/RESET)) U$9.VIN ; also sheet 7
7_4V_DUP: R19.2 ; also sheet 7,8
7_4V_TOP_DUP: C23.1 I_SENSE_AMP1.5(V+) ; also sheet 5,7,8
ADC6_DUP: U1.19(ADC6) ; also sheet 7
ADC7_DUP: U1.22(ADC7) ; also sheet 7
BATT_VOLTAGE_SENSE_DUP: R19.1 R20.2 U$9.17/A3
BLT_RX_DUP: U$9.8 ; also sheet 7
BLT_TX_DUP: U$9.7 ; also sheet 7
CAMERA_A0_B_DUP: U$9.31/A12 ; also sheet 7
CAMERA_A0_DUP: U1.23(PC0(ADC0)) ; also sheet 7
CAMERA_CL_B_DUP: U$9.30 ; also sheet 7
CAMERA_CL_DUP: U1.12(PB0(ICP)) ; also sheet 7
CAMERA_SI_B_DUP: U$9.29 ; also sheet 7
CAMERA_SI_DUP: U1.11(PD7(AIN1)) ; also sheet 7
EMF_SENSE_HIGH_DUP: R21.1 R22.2 U$9.19/A5/SCL
EMF_SENSE_LOW_DUP: U$9.18/A4/SDA ; also sheet 7
GND_DUP: C17.2 C18.2 D8.C D9.C D10.C R20.1 U1.3(GND) U1.5(GND) U1.21(AGND) U$9.AGND U$9.GND U$9.GND2 ; supply symbol labelled GND ; also sheet 7,8
GND_TOP_DUP: C23.2 I_SENSE_AMP1.2(V-) R36.1 ; also sheet 5,7,8
HALL1_B_DUP: U$9.1/TX ; also sheet 7
HALL1_DUP: U1.32(PD2(INT0)) ; also sheet 7
HALL2_B_DUP: U$9.2 ; also sheet 7
HALL2_DUP: U1.1(PD3(INT1)) ; also sheet 7
HI_DUP: U$9.3/CANTX ; also sheet 7
I_SENSE_DUP: U$9.5 ; also sheet 7
I_SENSE_HI_TOP_DUP: I_SENSE_AMP1.3(IN+) ; also sheet 5
I_SENSE_LOW_TOP_DUP: I_SENSE_AMP1.4(IN-) ; also sheet 5,7
I_SENSE_TOP_DUP: I_SENSE_AMP1.1(OUT) R36.2 ; also sheet 7
LED1_DUP: R27.2 U$9.14/A0
LED2_DUP: R28.2 U$9.15/A1
LED3_DUP: R29.2 U$9.16/A2
LI2_DUP: U$9.6
LI_DUP: U$9.4/CANRX ; also sheet 7
MOTOR_HIGH_DUP: R21.2 ; also sheet 7
MOTOR_LOW_DUP: R22.1 ; also sheet 7
N$33: C18.1 U1.7(PB6(XTAL1/TOSC1)) Y2.1
N$34: C17.1 U1.8(PB7(XTAL2/TOSC2)) Y2.2
N$35: D8.A R27.1
N$36: D9.A R28.1
N$37: D10.A R29.1
PB1_DUP: U1.13(PB1(OC1A)) ; also sheet 7
PC1_DUP: U1.24(PC1(ADC1)) ; also sheet 7
PC2_DUP: U1.25(PC2(ADC2)) ; also sheet 7
PC3_DUP: U1.26(PC3(ADC3)) ; also sheet 7
PC4_DUP: U1.27(PC4(ADC4/SDA)) ; also sheet 7
PC5_DUP: U1.28(PC5(ADC5/SCL)) ; also sheet 7
PD4_DUP: U1.2(PD4(XCK/T0)) ; also sheet 7
PD5_DUP: U1.9(PD5(T1)) ; also sheet 7
PD6_DUP: U1.10(PD6(AIN0))
REC_EXTRA1_DUP: U$9.22/A8 ; also sheet 7
REC_EXTRA2_DUP: U$9.23/A9 ; also sheet 7
REC_MOTOR_DUP: U$9.21/A7 ; also sheet 7
REC_SERVO_DUP: U$9.20/A6 ; also sheet 7
RX_DUP: U1.30(PD0(RXD)) ; also sheet 7
SERVO_DUP: U$9.9/CS ; also sheet 7
SPI_MISO_DUP: U1.16(PB4(MISO)) U$9.11/MOSI
SPI_MOSI_DUP: U1.15(PB3(MOSI/OC2)) U$9.12/MISO
SPI_SCK_DUP: U1.17(PB5(SCK)) U$9.13/SCK
SPI_SS_DUP: U1.14(PB2(SS/OC1B)) U$9.10/CS
SW1_DUP: U$9.24 ; also sheet 7
SW2_DUP: U$9.25 ; also sheet 7
SW3_DUP: U$9.26 ; also sheet 7
SW4_DUP: U$9.27 ; also sheet 7
SW5_DUP: U$9.28
TX_DUP: U1.31(PD1(TXD)) ; also sheet 7
Unconnected: U1.20(AREF) U$9.VUSB

### Notes on the sheet
- SPI between microcontrollers

## Sheet 7 of 8: Header schematic
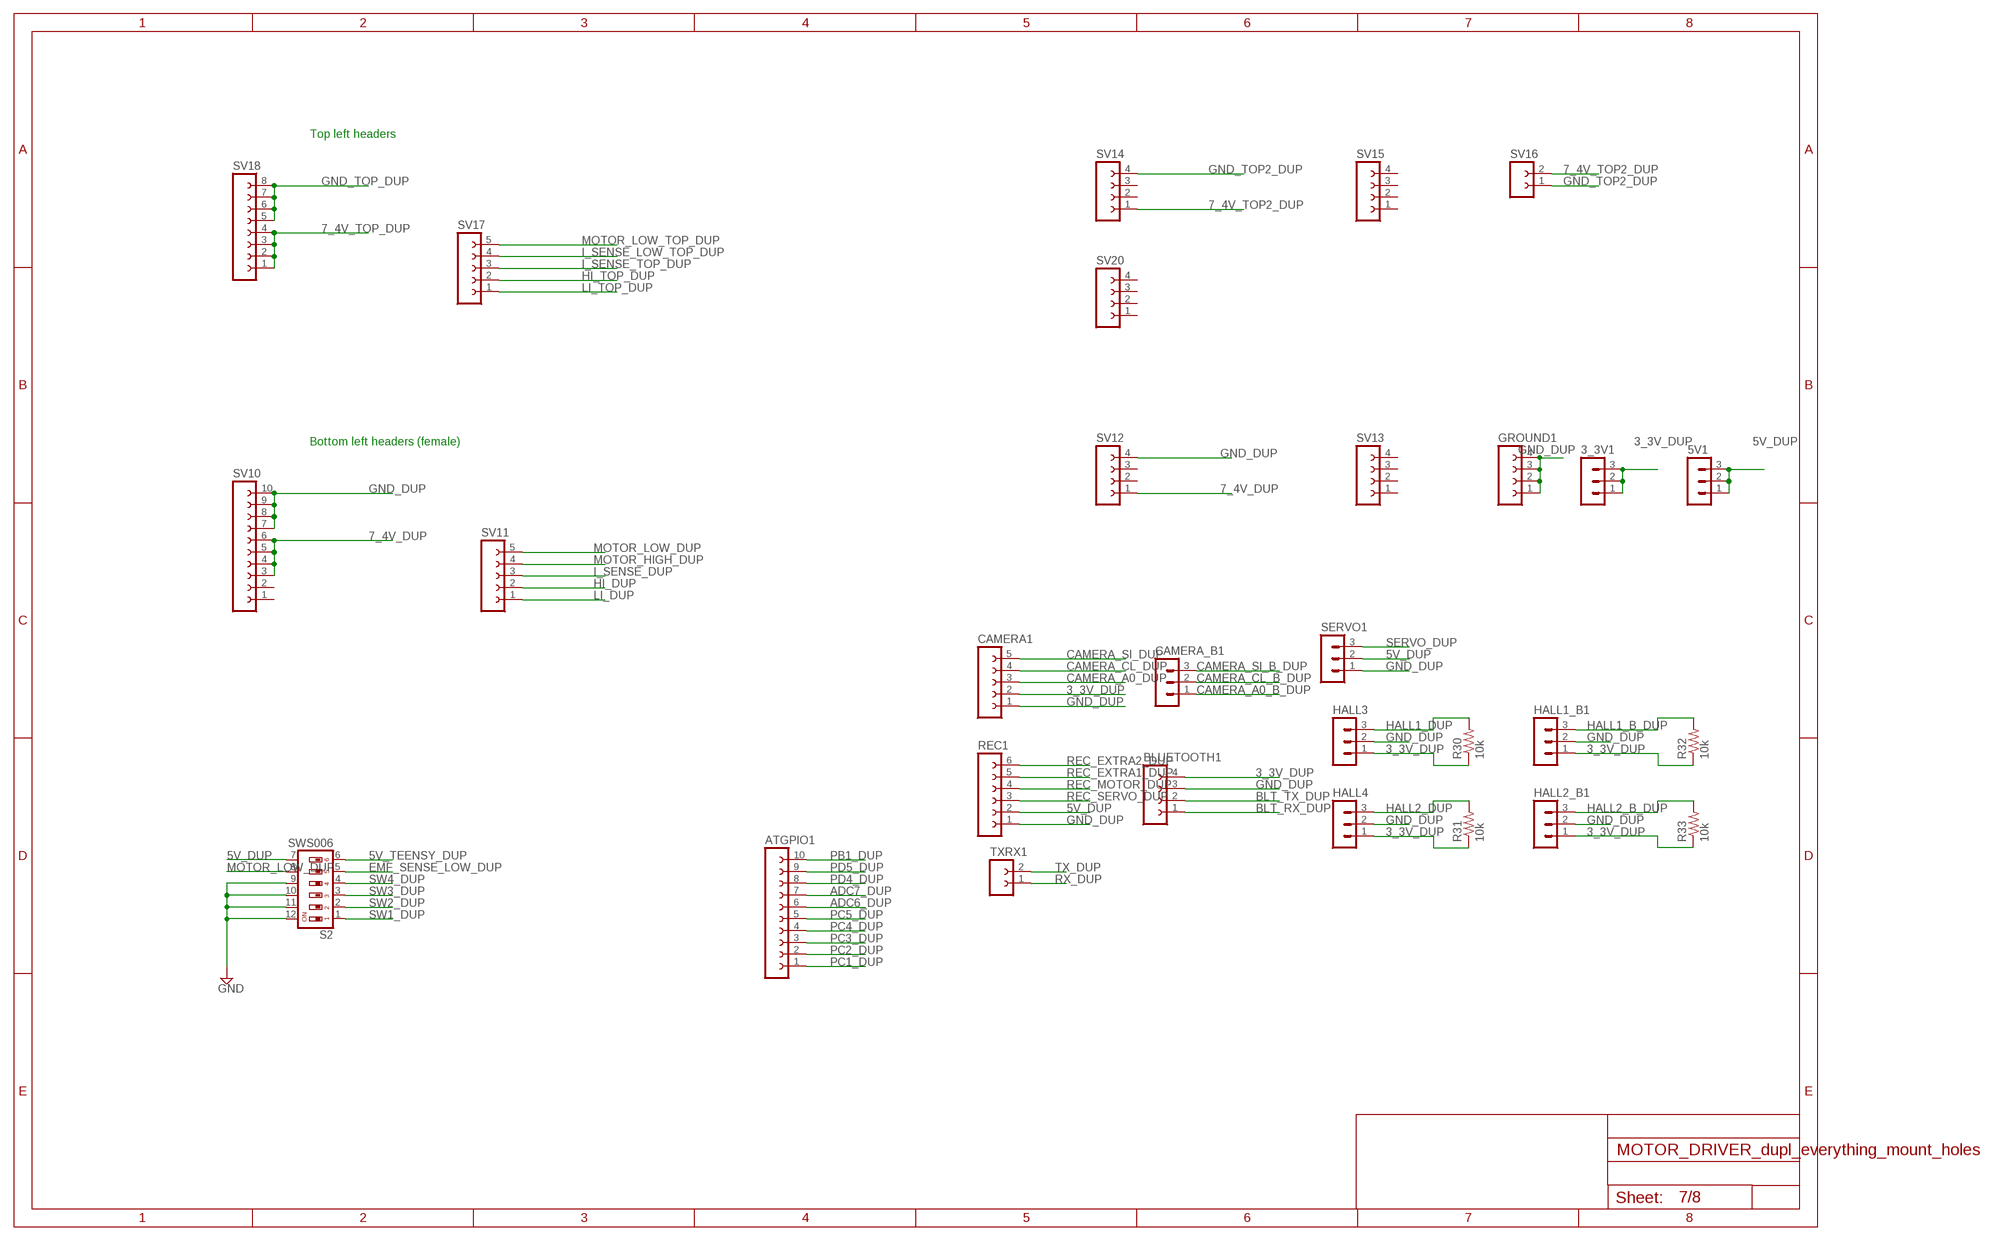
[diagram p6: schematic, sheet 7]

### Parts
3_3V1  MA03-1  [MA03-1]
5V1  MA03-1  [MA03-1]
ATGPIO1  FE10-1  [FE10]
BLUETOOTH1  FE04-1  [FE04-1]
CAMERA1  FE05-1  [FE05-1]
CAMERA_B1  MA03-1  [MA03-1]
GROUND1  FE04-1  [FE04-1]
HALL1_B1  MA03-1  [MA03-1]
HALL2_B1  MA03-1  [MA03-1]
HALL3  MA03-1  [MA03-1]
HALL4  MA03-1  [MA03-1]
R30  10k  R-US_R0603  [R0603]
R31  10k  R-US_R0603  [R0603]
R32  10k  R-US_R0603  [R0603]
R33  10k  R-US_R0603  [R0603]
REC1  FE06-1  [FE06]
S2  SWS006  [SMS-006]
SERVO1  MA03-1  [MA03-1]
SV10  FE10-1  [FE10]
SV11  FE05-1  [FE05-1]
SV12  FE04-1  [FE04-1]
SV13  FE04-1  [FE04-1]
SV14  FE04-1  [FE04-1]
SV15  FE04-1  [FE04-1]
SV16  FE02-1  [FE02-1]
SV17  FE05-1  [FE05-1]
SV18  FE08-1  [FE08]
SV20  FE04-1  [FE04-1]
TXRX1  FE02-1  [FE02-1]

### Nets
3_3V_DUP: 3_3V1.1 3_3V1.2 3_3V1.3 BLUETOOTH1.4 CAMERA1.2 HALL1_B1.1 HALL2_B1.1 HALL3.1 HALL4.1 R30.1 R31.1 R32.1 R33.1 ; also sheet 6
5V_DUP: 5V1.1 5V1.2 5V1.3 REC1.2 S2.7 SERVO1.2 ; also sheet 8
5V_TEENSY_DUP: S2.6 ; also sheet 6
7_4V_DUP: SV10.3 SV10.4 SV10.5 SV10.6 SV12.1 ; also sheet 6,8
7_4V_TOP2_DUP: SV14.1 SV16.2 ; also sheet 8
7_4V_TOP_DUP: SV18.1 SV18.2 SV18.3 SV18.4 ; also sheet 5,6,8
ADC6_DUP: ATGPIO1.6 ; also sheet 6
ADC7_DUP: ATGPIO1.7 ; also sheet 6
BLT_RX_DUP: BLUETOOTH1.1 ; also sheet 6
BLT_TX_DUP: BLUETOOTH1.2 ; also sheet 6
CAMERA_A0_B_DUP: CAMERA_B1.1 ; also sheet 6
CAMERA_A0_DUP: CAMERA1.3 ; also sheet 6
CAMERA_CL_B_DUP: CAMERA_B1.2 ; also sheet 6
CAMERA_CL_DUP: CAMERA1.4 ; also sheet 6
CAMERA_SI_B_DUP: CAMERA_B1.3 ; also sheet 6
CAMERA_SI_DUP: CAMERA1.5 ; also sheet 6
EMF_SENSE_LOW_DUP: S2.5 ; also sheet 6
GND_DUP: BLUETOOTH1.3 CAMERA1.1 GROUND1.1 GROUND1.2 GROUND1.3 GROUND1.4 HALL1_B1.2 HALL2_B1.2 HALL3.2 HALL4.2 REC1.1 S2.9 S2.10 S2.11 S2.12 SERVO1.1 SV10.7 SV10.8 SV10.9 SV10.10 SV12.4 ; supply symbol labelled GND ; also sheet 6,8
GND_TOP2_DUP: SV14.4 SV16.1 ; also sheet 8
GND_TOP_DUP: SV18.5 SV18.6 SV18.7 SV18.8 ; also sheet 5,6,8
HALL1_B_DUP: HALL1_B1.3 R32.2 ; also sheet 6
HALL1_DUP: HALL3.3 R30.2 ; also sheet 6
HALL2_B_DUP: HALL2_B1.3 R33.2 ; also sheet 6
HALL2_DUP: HALL4.3 R31.2 ; also sheet 6
HI_DUP: SV11.2 ; also sheet 6
HI_TOP_DUP: SV17.2 ; also sheet 5
I_SENSE_DUP: SV11.3 ; also sheet 6
I_SENSE_LOW_TOP_DUP: SV17.4 ; also sheet 5,6
I_SENSE_TOP_DUP: SV17.3 ; also sheet 6
LI_DUP: SV11.1 ; also sheet 6
LI_TOP_DUP: SV17.1 ; also sheet 5
MOTOR_HIGH_DUP: SV11.4 ; also sheet 6
MOTOR_LOW_DUP: S2.8 SV11.5 ; also sheet 6
MOTOR_LOW_TOP_DUP: SV17.5 ; also sheet 5
PB1_DUP: ATGPIO1.10 ; also sheet 6
PC1_DUP: ATGPIO1.1 ; also sheet 6
PC2_DUP: ATGPIO1.2 ; also sheet 6
PC3_DUP: ATGPIO1.3 ; also sheet 6
PC4_DUP: ATGPIO1.4 ; also sheet 6
PC5_DUP: ATGPIO1.5 ; also sheet 6
PD4_DUP: ATGPIO1.8 ; also sheet 6
PD5_DUP: ATGPIO1.9 ; also sheet 6
REC_EXTRA1_DUP: REC1.5 ; also sheet 6
REC_EXTRA2_DUP: REC1.6 ; also sheet 6
REC_MOTOR_DUP: REC1.4 ; also sheet 6
REC_SERVO_DUP: REC1.3 ; also sheet 6
RX_DUP: TXRX1.1 ; also sheet 6
SERVO_DUP: SERVO1.3 ; also sheet 6
SW1_DUP: S2.1 ; also sheet 6
SW2_DUP: S2.2 ; also sheet 6
SW3_DUP: S2.3 ; also sheet 6
SW4_DUP: S2.4 ; also sheet 6
TX_DUP: TXRX1.2 ; also sheet 6
Unconnected: SV10.1 SV10.2 SV12.2 SV12.3 SV13.1 SV13.2 SV13.3 SV13.4 SV14.2 SV14.3 SV15.1 SV15.2 SV15.3 SV15.4 SV20.1 SV20.2 SV20.3 SV20.4

### Notes on the sheet
- Top left headers
- Bottom left headers (female)

## Sheet 8 of 8: Power Schematic
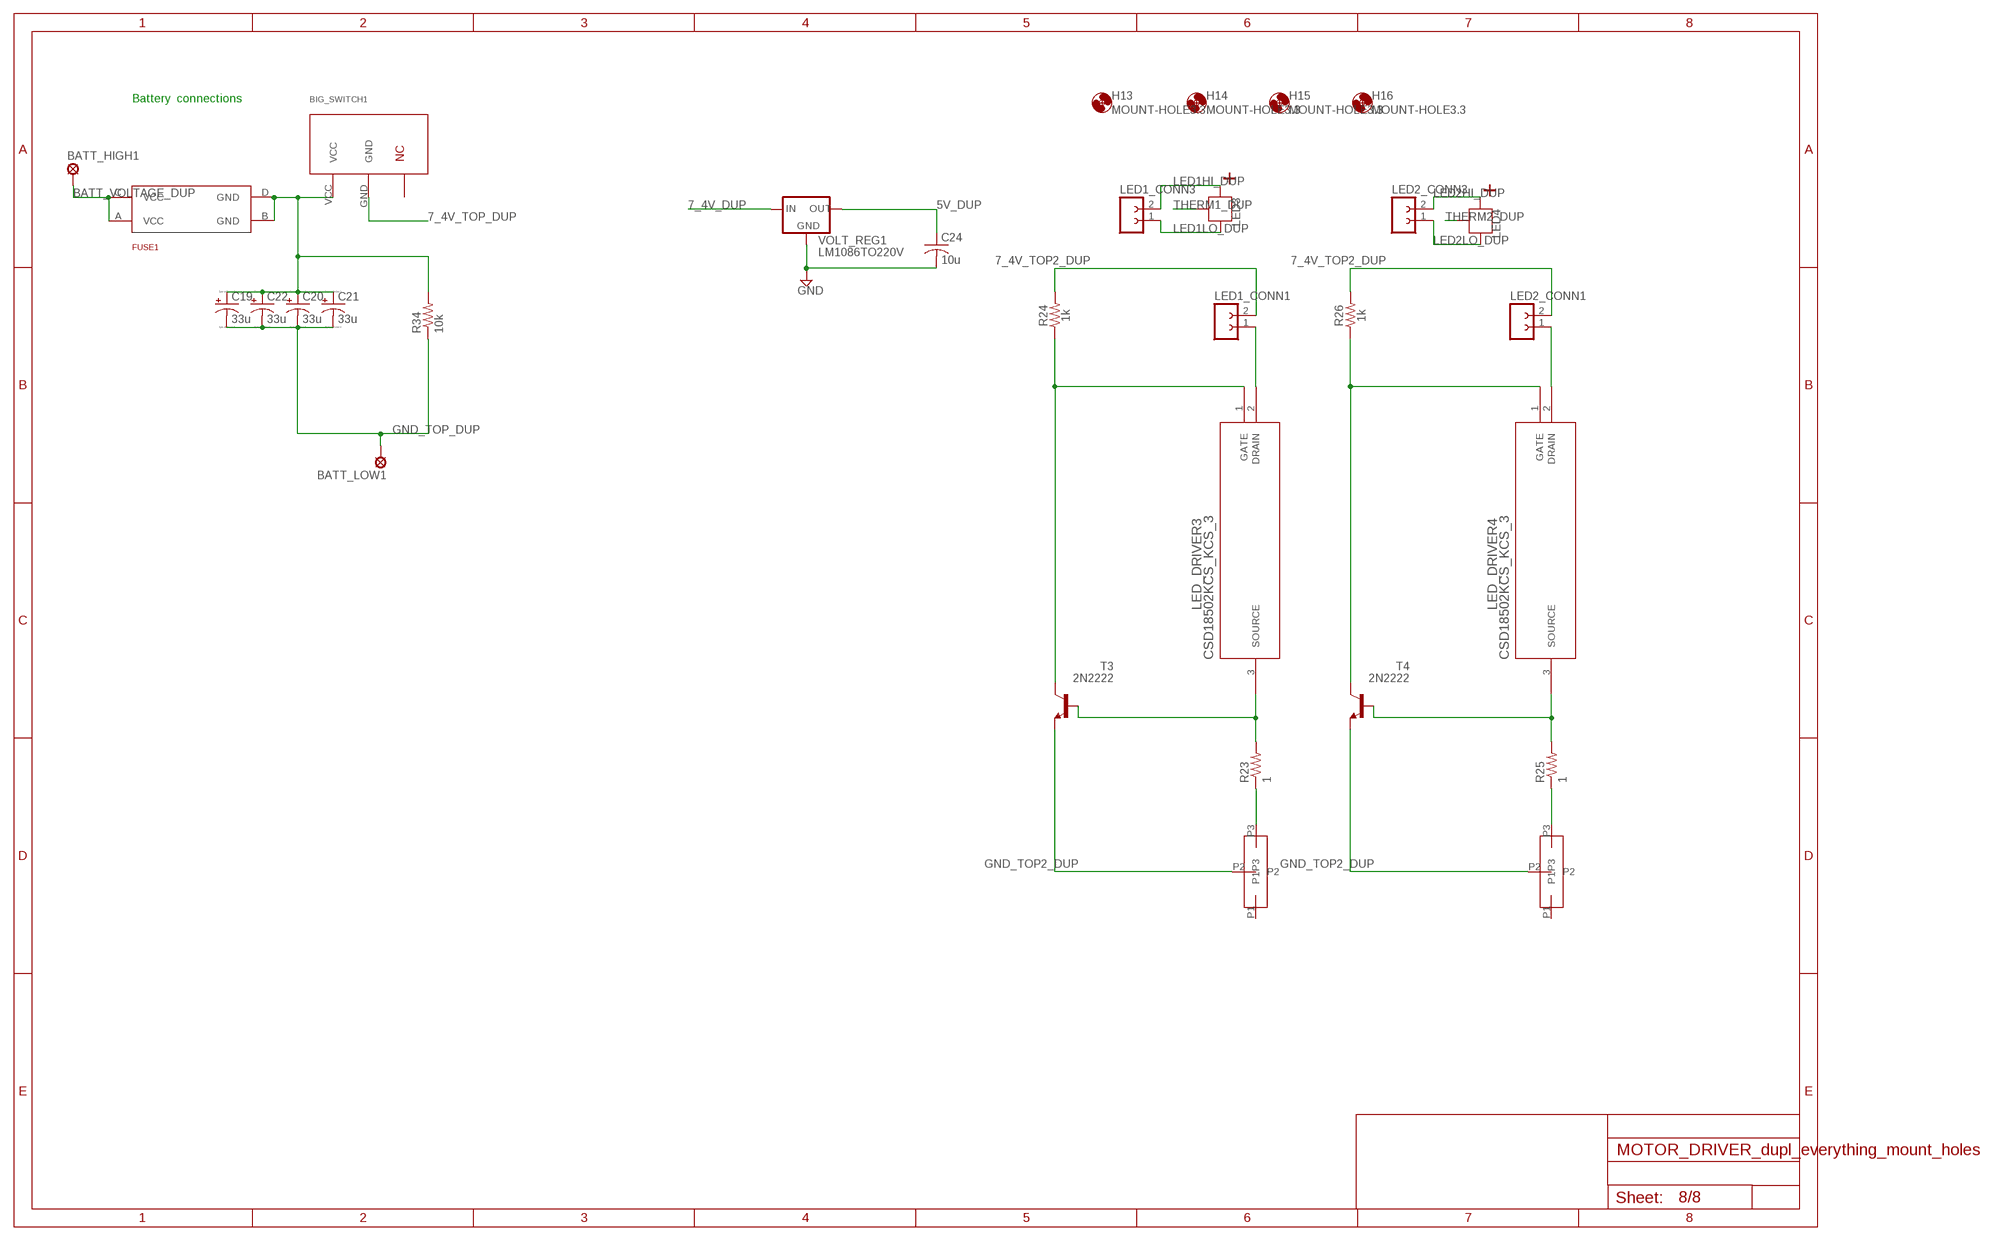
[diagram p7: schematic, sheet 8]

### Parts
BATT_HIGH1  SE14  [SE14]
BATT_LOW1  SE14  [SE14]
BIG_SWITCH1  BIGSWITCH  [BIGSWITCH]
C19  33u  CPOL-US153CLV-1010  [153CLV-1010]
C20  33u  CPOL-US153CLV-1010  [153CLV-1010]
C21  33u  CPOL-US153CLV-1010  [153CLV-1010]
C22  33u  CPOL-US153CLV-1010  [153CLV-1010]
C24  10u  C-USC0805  [C0805]
FUSE1  FUSEHOLDER3588  [FUSEHOLDER3588]
H13  MOUNT-HOLE3.3  [3,3]
H14  MOUNT-HOLE3.3  [3,3]
H15  MOUNT-HOLE3.3  [3,3]
H16  MOUNT-HOLE3.3  [3,3]
LED1_CONN1  FE02-1  [FE02-1]
LED1_CONN3  FE02-1  [FE02-1]
LED2_CONN1  FE02-1  [FE02-1]
LED2_CONN3  FE02-1  [FE02-1]
LED3  CREE_XP  [XP]
LED4  CREE_XP  [XP]
LED_DRIVER3  CSD18502KCS_KCS_3  [KCS3]
LED_DRIVER4  CSD18502KCS_KCS_3  [KCS3]
R23  1  R-US_R2512  [R2512]
R24  1k  1KOHM-HORIZ-1/4W-1%  [AXIAL-0.3]
R25  1  R-US_R2512  [R2512]
R26  1k  1KOHM-HORIZ-1/4W-1%  [AXIAL-0.3]
R34  10k  R-US_R0603  [R0603]
T3  2N2222  [TO18]
T4  2N2222  [TO18]
U$14  POT  [POT]
U$15  POT  [POT]
VOLT_REG1  LM1086TO220V  [TO220S]

### Nets
5V_DUP: C24.1 VOLT_REG1.2(OUT) ; also sheet 7
7_4V_DUP: VOLT_REG1.3(IN) ; also sheet 6,7
7_4V_TOP2_DUP: LED1_CONN1.2 LED2_CONN1.2 R24.P$2 R26.P$2 ; also sheet 7
7_4V_TOP_DUP: BIG_SWITCH1.GND ; also sheet 5,6,7
BATT_VOLTAGE_DUP: BATT_HIGH1.MP FUSE1.A(VCC) FUSE1.C(VCC)
GND_DUP: C24.2 VOLT_REG1.1(GND) ; supply symbol labelled GND ; also sheet 6,7
GND_TOP2_DUP: T3.1(E) T4.1(E) U$14.P2 U$15.P2 ; also sheet 7
GND_TOP_DUP: BATT_LOW1.MP C19.- C20.- C21.- C22.- R34.1 ; also sheet 5,6,7
LED1HI_DUP: LED1_CONN3.2 LED3.POSITIVE LED3.POSITIVE1(POSITIVE)
LED1LO_DUP: LED1_CONN3.1 LED3.NEGATIVE LED3.NEGATIVE1(NEGATIVE)
LED2HI_DUP: LED2_CONN3.2 LED4.POSITIVE LED4.POSITIVE1(POSITIVE)
LED2LO_DUP: LED2_CONN3.1 LED4.NEGATIVE LED4.NEGATIVE1(NEGATIVE)
N$38: BIG_SWITCH1.VCC C19.+ C20.+ C21.+ C22.+ FUSE1.B(GND) FUSE1.D(GND) R34.2
N$39: R23.1 U$14.P3
N$40: LED_DRIVER3.3(SOURCE) R23.2 T3.2(B)
N$41: LED_DRIVER3.1(GATE) R24.P$1 T3.3(C)
N$42: LED1_CONN1.1 LED_DRIVER3.2(DRAIN)
N$43: R25.1 U$15.P3
N$44: LED_DRIVER4.3(SOURCE) R25.2 T4.2(B)
N$45: LED_DRIVER4.1(GATE) R26.P$1 T4.3(C)
N$46: LED2_CONN1.1 LED_DRIVER4.2(DRAIN)
THERM1_DUP: LED3.THERMAL
THERM2_DUP: LED4.THERMAL
Unconnected: U$14.P1 U$15.P1

### Notes on the sheet
- Battery  connections

## Library data of the parts
3_3V 3_3V1 5V 5V1 = con-lstb:MA03-1: PIN HEADER; OC_FARNELL: unknown; OC_NEWARK: unknown
ATGPIO ATGPIO1 SV1 SV10 = con-lsta:FE10-1: FEMALE HEADER
BATT_HIGH BATT_HIGH1 BATT_LOW BATT_LOW1 MOTOR_NEG MOTOR_NEG1 MOTOR_NEG_B MOTOR_NEG_B1 MOTOR_POS MOTOR_POS1 = solpad:SE14: SOLDER PAD E1553, drill 1,4mm, distributor Buerklin, 07F820
BIG_SWITCH BIG_SWITCH1 = bigswitch:BIGSWITCH: Rocker Switch SPST 25A (DC) Panel Mount, Snap-In; DIGIKEY_PART_NUMBER: CW106-ND; MANUFACTURER: CW Industries; MANUFACTURER_PART_NUMBER: GRB238B801BR1; PRICE: $2.86
BLUETOOTH BLUETOOTH1 = con-lsta:FE04-1: FEMALE HEADER; MANUFACTURER: HC Information Technology; MANUFACTURER_PART_NUMBER: HC-06
BOT_FWD BOT_FWD1 BOT_REV BOT_REV1 LED_DRIVER1-LED_DRIVER4 TOP_FWD TOP_FWD1 TOP_REV TOP_REV1 = CSD18502KCS:CSD18502KCS_KCS_3: MOSFET N-CH 60V 100A TO220-3; DIGIKEY_PART_NUMBER: 296-35013-ND; MANUFACTURER: Texas Instruments; MANUFACTURER_PART_NUMBER: CSD18533KCS; PRICE: $1.53
C1-C4 C9-C11 C16 = cap-aluminum:EEE1VA100WR; MANUFACTURER_PART_NUMBER: EEE1VA100WR; VENDOR: Panasonic
C5 C6 C8 C17 C18 C24 = rcl:C-US: CAPACITOR, American symbol
C7 C23 = resistor:C-US: CAPACITOR, American symbol
C12-C15 C19-C22 = resistor:CPOL-US: POLARIZED CAPACITOR, American symbol
CAMERA CAMERA1 = con-lsta:FE05-1: FEMALE HEADER; DIGIKEY_PART_NUMBER: 28317-ND; MANUFACTURER: Parallax; MANUFACTURER_PART_NUMBER: 28317; OC_FARNELL: unknown; OC_NEWARK: unknown; PRICE: $49.99
CAMERA_B CAMERA_B1 = con-lstb:MA03-1: PIN HEADER; DIGIKEY_PART_NUMBER: 28317-ND; MANUFACTURER: Parallax; MANUFACTURER_PART_NUMBER: 28317; OC_FARNELL: unknown; OC_NEWARK: unknown; PRICE: $49.99
D1 D2 D5 D8-D10 = SparkFun-LED:LED: LED (Generic) Standard schematic elements and footprints for 5mm, 3mm, 1206, and 0603 sized LEDs. Generic LEDs with no color specified.
D3 D4 D6 D7 = diode:BYV32: DIODE 2 x Si diode 200 V, 20 A/230 Apeak, 25 ns
FUSE FUSE1 = minifuse:FUSEHOLDER3588: Fuseholder for Keystone 3588 mini fuse; DIGIKEY_PART_NUMBER: F4989-ND; MANUFACTURER: Littelfuse Inc.; MANUFACTURER_PART_NUMBER: 0891010.NXS; PRICE: $0.37
GATE1-GATE4 = MIC4604:MIC4604YM: IC DRIVER MOSFET 85V 8-SOIC; DIGIKEY_PART_NUMBER: 576-4395-1-ND; MANUFACTURER: Microchip; MANUFACTURER_PART_NUMBER: MIC4604YM-T5; PRICE: $1.25
GROUND GROUND1 SV3 SV4 SV7 SV8 SV12-SV15 SV19 SV20 = con-lsta:FE04-1: FEMALE HEADER
H1-H16 = holes:MOUNT-HOLE: MOUNTING HOLE with drill center marker
HALL1 HALL1_B HALL1_B1 HALL2 HALL2_B HALL2_B1 HALL3 HALL4 = con-lstb:MA03-1: PIN HEADER; DIGIKEY_PART_NUMBER: US1881LUA-AAA-000-BU-ND; MANUFACTURER: Melexis Technologies NV; MANUFACTURER_PART_NUMBER: US1881LUA-AAA-000-BU; OC_FARNELL: unknown; OC_NEWARK: unknown; PRICE: $0.95
I_SENSE_AMP I_SENSE_AMP1 = burr-brown:INA138: High-Side Measurement Current Shunt Monitor; DIGIKEY_PART_NUMBER: INA138NACT-ND; MANUFACTURER: Texas Instruments; MANUFACTURER_PART_NUMBER: INA138NA/250
LED1-LED4 = Cree_XP:CREE_XP
LED1_CONN LED1_CONN1-LED1_CONN3 LED2_CONN LED2_CONN1-LED2_CONN3 SV9 SV16 TXRX TXRX1 = con-lsta:FE02-1: FEMALE HEADER
R1 R19 = SparkFun-Resistors:0.3OHM: 0.3O resistor A resistor is a passive two-terminal electrical component that implements electrical resistance as a circuit element. Resistors act to reduce current flow, and, at the same time, act to lower voltage levels within circuits. - Wikipedia; DIGIKEY_PART_NUMBER: 311-2.80KCRCT-ND; MANUFACTURER: Yageo; MANUFACTURER_PART_NUMBER: RC0805FR-072K8L; PRICE: $0.10; VALUE: 0.3
R2 R20 = SparkFun-Resistors:0.3OHM: 0.3O resistor A resistor is a passive two-terminal electrical component that implements electrical resistance as a circuit element. Resistors act to reduce current flow, and, at the same time, act to lower voltage levels within circuits. - Wikipedia; DIGIKEY_PART_NUMBER: 311-1.62KCRCT-ND; MANUFACTURER: Yageo; MANUFACTURER_PART_NUMBER: RC0805FR-071K62L; PRICE: $0.10; VALUE: 0.3
R3 R21 = SparkFun-Resistors:0.3OHM: 0.3O resistor A resistor is a passive two-terminal electrical component that implements electrical resistance as a circuit element. Resistors act to reduce current flow, and, at the same time, act to lower voltage levels within circuits. - Wikipedia; DIGIKEY_PART_NUMBER: 311-2.32KCRCT-ND; MANUFACTURER: Yageo; MANUFACTURER_PART_NUMBER: RC0805FR-072K32L; PRICE: $0.10; VALUE: 0.3
R4 R22 = SparkFun-Resistors:0.3OHM: 0.3O resistor A resistor is a passive two-terminal electrical component that implements electrical resistance as a circuit element. Resistors act to reduce current flow, and, at the same time, act to lower voltage levels within circuits. - Wikipedia; DIGIKEY_PART_NUMBER: 311-1.15KCRCT-ND; MANUFACTURER: Yageo; MANUFACTURER_PART_NUMBER: RC0805FR-071K15L; PRICE: $0.10; VALUE: 0.3
R5 R7 R9-R11 R17 R18 R23 R25 R27-R29 R35 R36 = rcl:R-US_: RESISTOR, American symbol
R6 R8 R24 R26 = SparkFun-Resistors:1KOHM: 1kO resistor A resistor is a passive two-terminal electrical component that implements electrical resistance as a circuit element. Resistors act to reduce current flow, and, at the same time, act to lower voltage levels within circuits. - Wikipedia; PROD_ID: RES-12182
R12-R16 R30-R34 = resistor:R-US_: RESISTOR, American symbol
REC REC1 = con-lsta:FE06-1: FEMALE HEADER; OC_FARNELL: unknown; OC_NEWARK: unknown
S1 S2 = smd-special:SWS006: SMD Dip Switch 6 pol.; DIGIKEY_PART_NUMBER: CT2196MST-ND; MANUFACTURER: CTS Electrocomponents; MANUFACTURER_PART_NUMBER: 219-6MST; PRICE: $0.91
SERVO SERVO1 = con-lstb:MA03-1: PIN HEADER; MANUFACTURER: TrackStar; MANUFACTURER_PART_NUMBER: TS-P12S; OC_FARNELL: unknown; OC_NEWARK: unknown; PRICE: $18.41
SV2 SV6 SV11 SV17 = con-lsta:FE05-1: FEMALE HEADER; OC_FARNELL: unknown; OC_NEWARK: unknown
SV5 SV18 = con-lsta:FE08-1: FEMALE HEADER; OC_FARNELL: unknown; OC_NEWARK: unknown
T1-T4 = transistor:2N2222: NPN TRANSISTOR
U1 U7 = SparkFun-IC-Microcontroller:ATMEGA328P_TQFP: Popular 328P in QFP Storefront component: ATmega328 - TQFP <https://www.sparkfun.com/products/13448> (COM-13448) Datasheet <http://www.sparkfun.com/datasheets/Components/SMD/ATMega328.pdf> SparkFun Products SparkFun RedBoard - Programmed with Arduino <https://www.sparkfun.com/products/12757> (DEV-12757) Arduino Pro Mini 328 - 5V/16MHz <https://www.sparkfun.com/products/11113> (DEV-11113) Arduino Pro Mini 328 - 3.3V/8MHz <https://www.sparkfun.com/products/11114> (DEV-11114) SparkFun OpenLog <https://www.sparkfun.com/products/13712> (DEV-13712) SparkFun MicroView - OLED Arduino Module <https://www.sparkfun.com/products/12923> (DEV-12923) SparkFun Digital Sandbox <https://www.sparkfun.com/products/12651> (DEV-12651) SparkFun PicoBoard <https://www.sparkfun.com/products/11888> (WIG-11888) Arduino Fio <https://www.sparkfun.com/products/10116> (DEV-10116) LilyPad Arduino 328 Main Board <https://www.sparkfun.com/products/13342> (DEV-13342) SparkFun RedStick <https://www.sparkfun.com/products/13741> (DEV-13741) LilyPad MP3 <https://www.sparkfun.com/products/11013> (DEV-11013) LilyPad Arduino SimpleSnap <https://www.sparkfun.com/products/10941> (DEV-10941) SparkFun Stepoko <https://www.sparkfun.com/products/13899> (ROB-13899) SparkFun Geiger Counter <https://www.sparkfun.com/products/11345> (SEN-11345) SparkFun EL Sequencer <https://www.sparkfun.com/products/12781> (COM-12781) Arduino Pro 328 - 5V/16MHz <https://www.sparkfun.com/products/10915> (DEV-10915) CryptoCape <https://www.sparkfun.com/products/12773> (DEV-12773) SparkFun IR Thermometer Evaluation Board - MLX90614 <https://www.sparkfun.com/products/10740> (SEN-10740) SparkFun RedBot Mainboard <https://www.sparkfun.com/products/12097> (ROB-12097) Arduino Pro 328 - 3.3V/8MHz <https://www.sparkfun.com/products/10914> (DEV-10914) SparkFun Block for Intel® Edison - Arduino <https://www.sparkfun.com/products/13036> (DEV-13036) SparkFun Simon Says - Surface Mount Soldering Kit <https://www.sparkfun.com/products/10935> (KIT-10935) SparkFun 7-Segment Serial Display - Red <https://www.sparkfun.com/products/11441> (COM-11441) SparkFun 7-Segment Serial Display - White <https://www.sparkfun.com/products/11629> (COM-11629) SparkFun 7-Segment Serial Display - Yellow <https://www.sparkfun.com/products/11443> (COM-11443) SparkFun 7-Segment Serial Display - Kelly Green <https://www.sparkfun.com/products/11440> (COM-11440) SparkFun 7-Segment Serial Display - Blue <https://www.sparkfun.com/products/11442> (COM-11442) SparkFun OpenSegment Serial Display - 20mm (Blue) <https://www.sparkfun.com/products/11647> (COM-11647) SparkFun OpenSegment Serial Display - 20mm (Green) <https://www.sparkfun.com/products/11646> (COM-11646) SparkFun OpenSegment Serial Display - 20mm (White) <https://www.sparkfun.com/products/11648> (COM-11648) SparkFun OpenSegment Serial Display - 20mm (Red) <https://www.sparkfun.com/products/11644> (COM-11644) SparkFun OpenSegment Serial Display - 20mm (Yellow) <https://www.sparkfun.com/products/11645> (COM-11645) SparkFun OpenSegment Shield <https://www.sparkfun.com/products/13190> (DEV-13190); DIGIKEY_PART_NUMBER: ATMEGA328PB-AU-ND; MANUFACTURER: Microchip Technology; MANUFACTURER_PART_NUMBER: ATMEGA328PB-AU; PRICE: $1.38
U$1 U$9 = Teensy356:TEENSY_3.5/3.6_FEWER; DIGIKEY_PART_NUMBER: 1568-1443-ND; MANUFACTURER: SparkFun Electronics; MANUFACTURER_PART_NUMBER: DEV-14055; PRICE: $26.25
U$2 U$4-U$6 U$10-U$13 = heatsink:HEATSINK; DIGIKEY_PART_NUMBER: HS112-ND; MANUFACTURER: Aavid Thermalloy; MANUFACTURER_PART_NUMBER: 507002B00000G; PRICE: $0.26
U$3 U$7 U$14 U$15 = ledpot:POT
VOLT_REG VOLT_REG1 = v-reg-3:LM1086; DIGIKEY_PART_NUMBER: LM1086IT-5.0/NOPB-ND; MANUFACTURER: Texas Instruments; MANUFACTURER_PART_NUMBER: LM1086IT-5.0/NOPB; PRICE: $1.67
Y1 Y2 = SparkFun-Clocks:CRYSTAL-16MHZ: 16MHz Crystal Digikey Example <http://www.digikey.com/product-search/en?keywords=535-9122-1-ND> Frequency: 16MHz Frequency Stability: ±50ppm Frequency Tolerance: ±20ppm Load Capacitance: 18pF SparkFun Products: Pro Micro -5V/16MHz <https://www.sparkfun.com/products/12640> SparkFun Serial Enabled LCD Kit <https://www.sparkfun.com/products/10097>; DIGIKEY_PART_NUMBER: 887-2425-1-ND; MANUFACTURER: TXC CORPORATION; MANUFACTURER_PART_NUMBER: 9C-16.000MBBK-T; PRICE: $0.36

## Net classes
0 default: width 0.152 mm, drill 0.381 mm, clearance 0.152 mm